# EasyEDA Pro project NeuraCore-Final.epro, schematic schematic1, sheets 1 to 6 of 13

## Sheets
1 Misc: Board Name: Board1; Create Date: 2024-11-09; Page Name: Misc; Project Name: FPGA Dev Board - XILINX XC7Z020-1CLG484I v0.07; Schematic Name: schematic1; Update Date: 2025-03-01; Company: EasyEDA.com; Drawn: rehsd; Page Size: B; Part Number: JLCPCB-002; Reviewed: EasyEDA; Version: V0.1
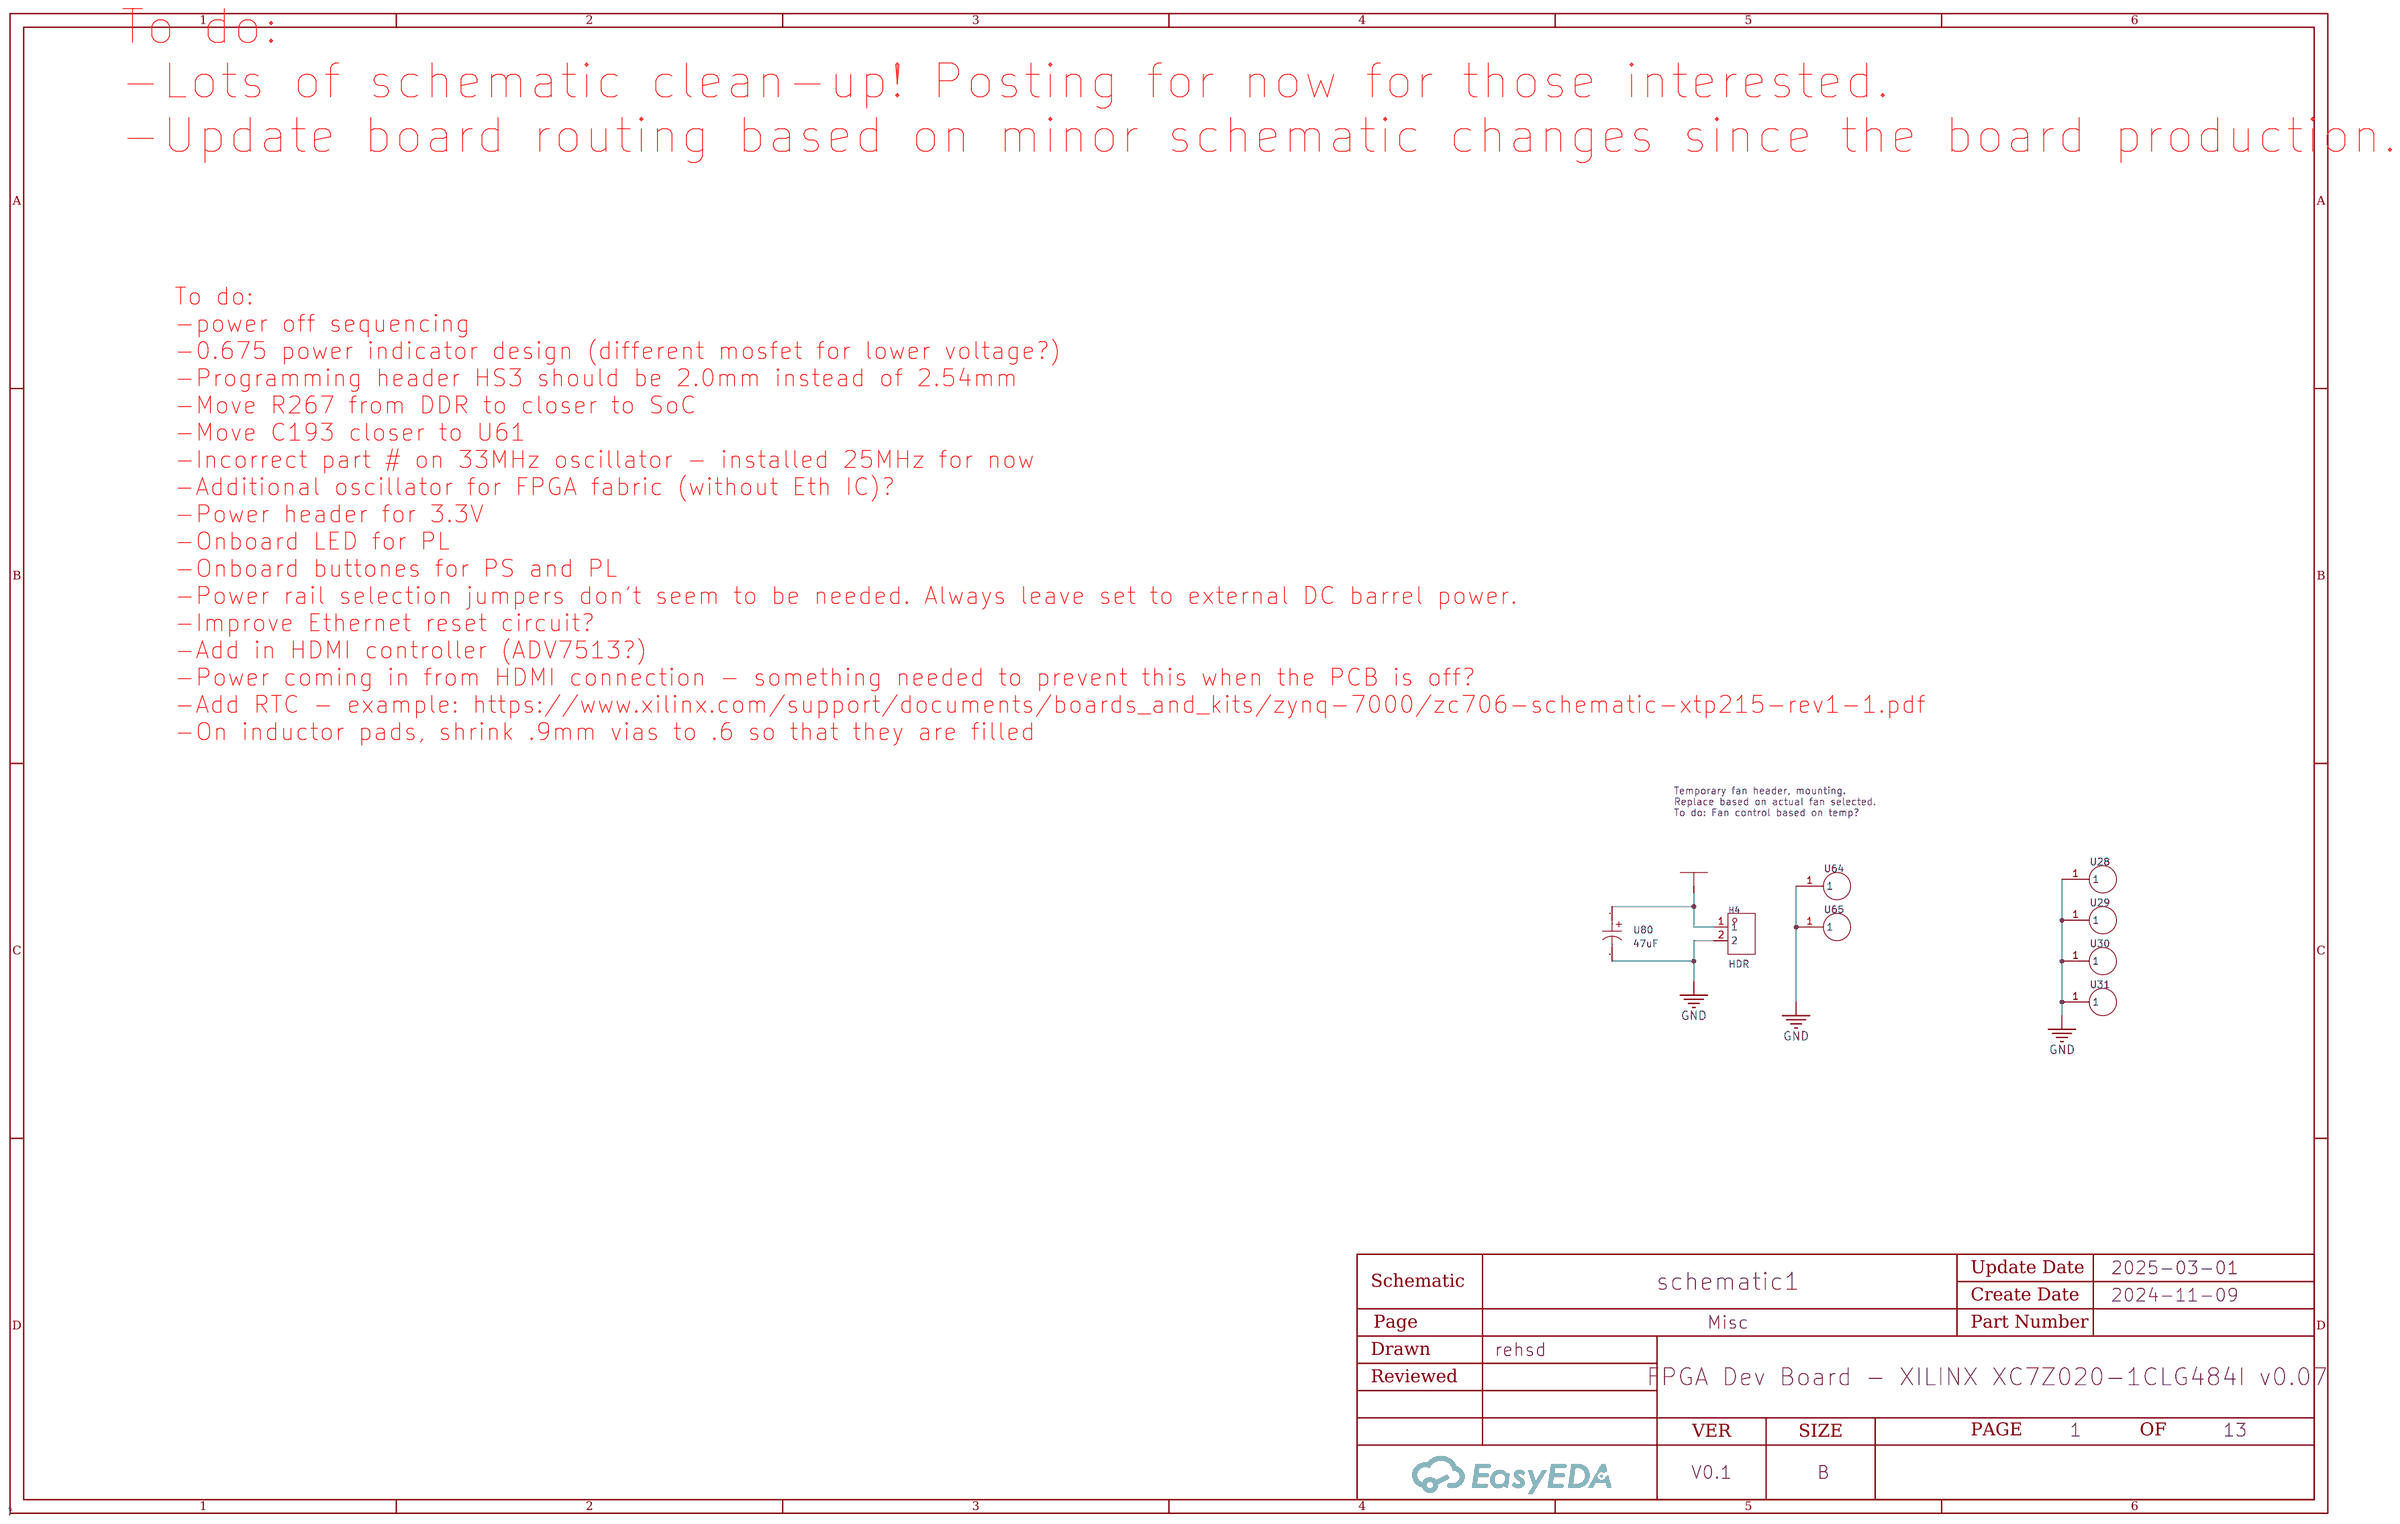
[diagram p0: Misc]
2 Regulators: Page Name: Regulators; Update Date: 2024-11-09
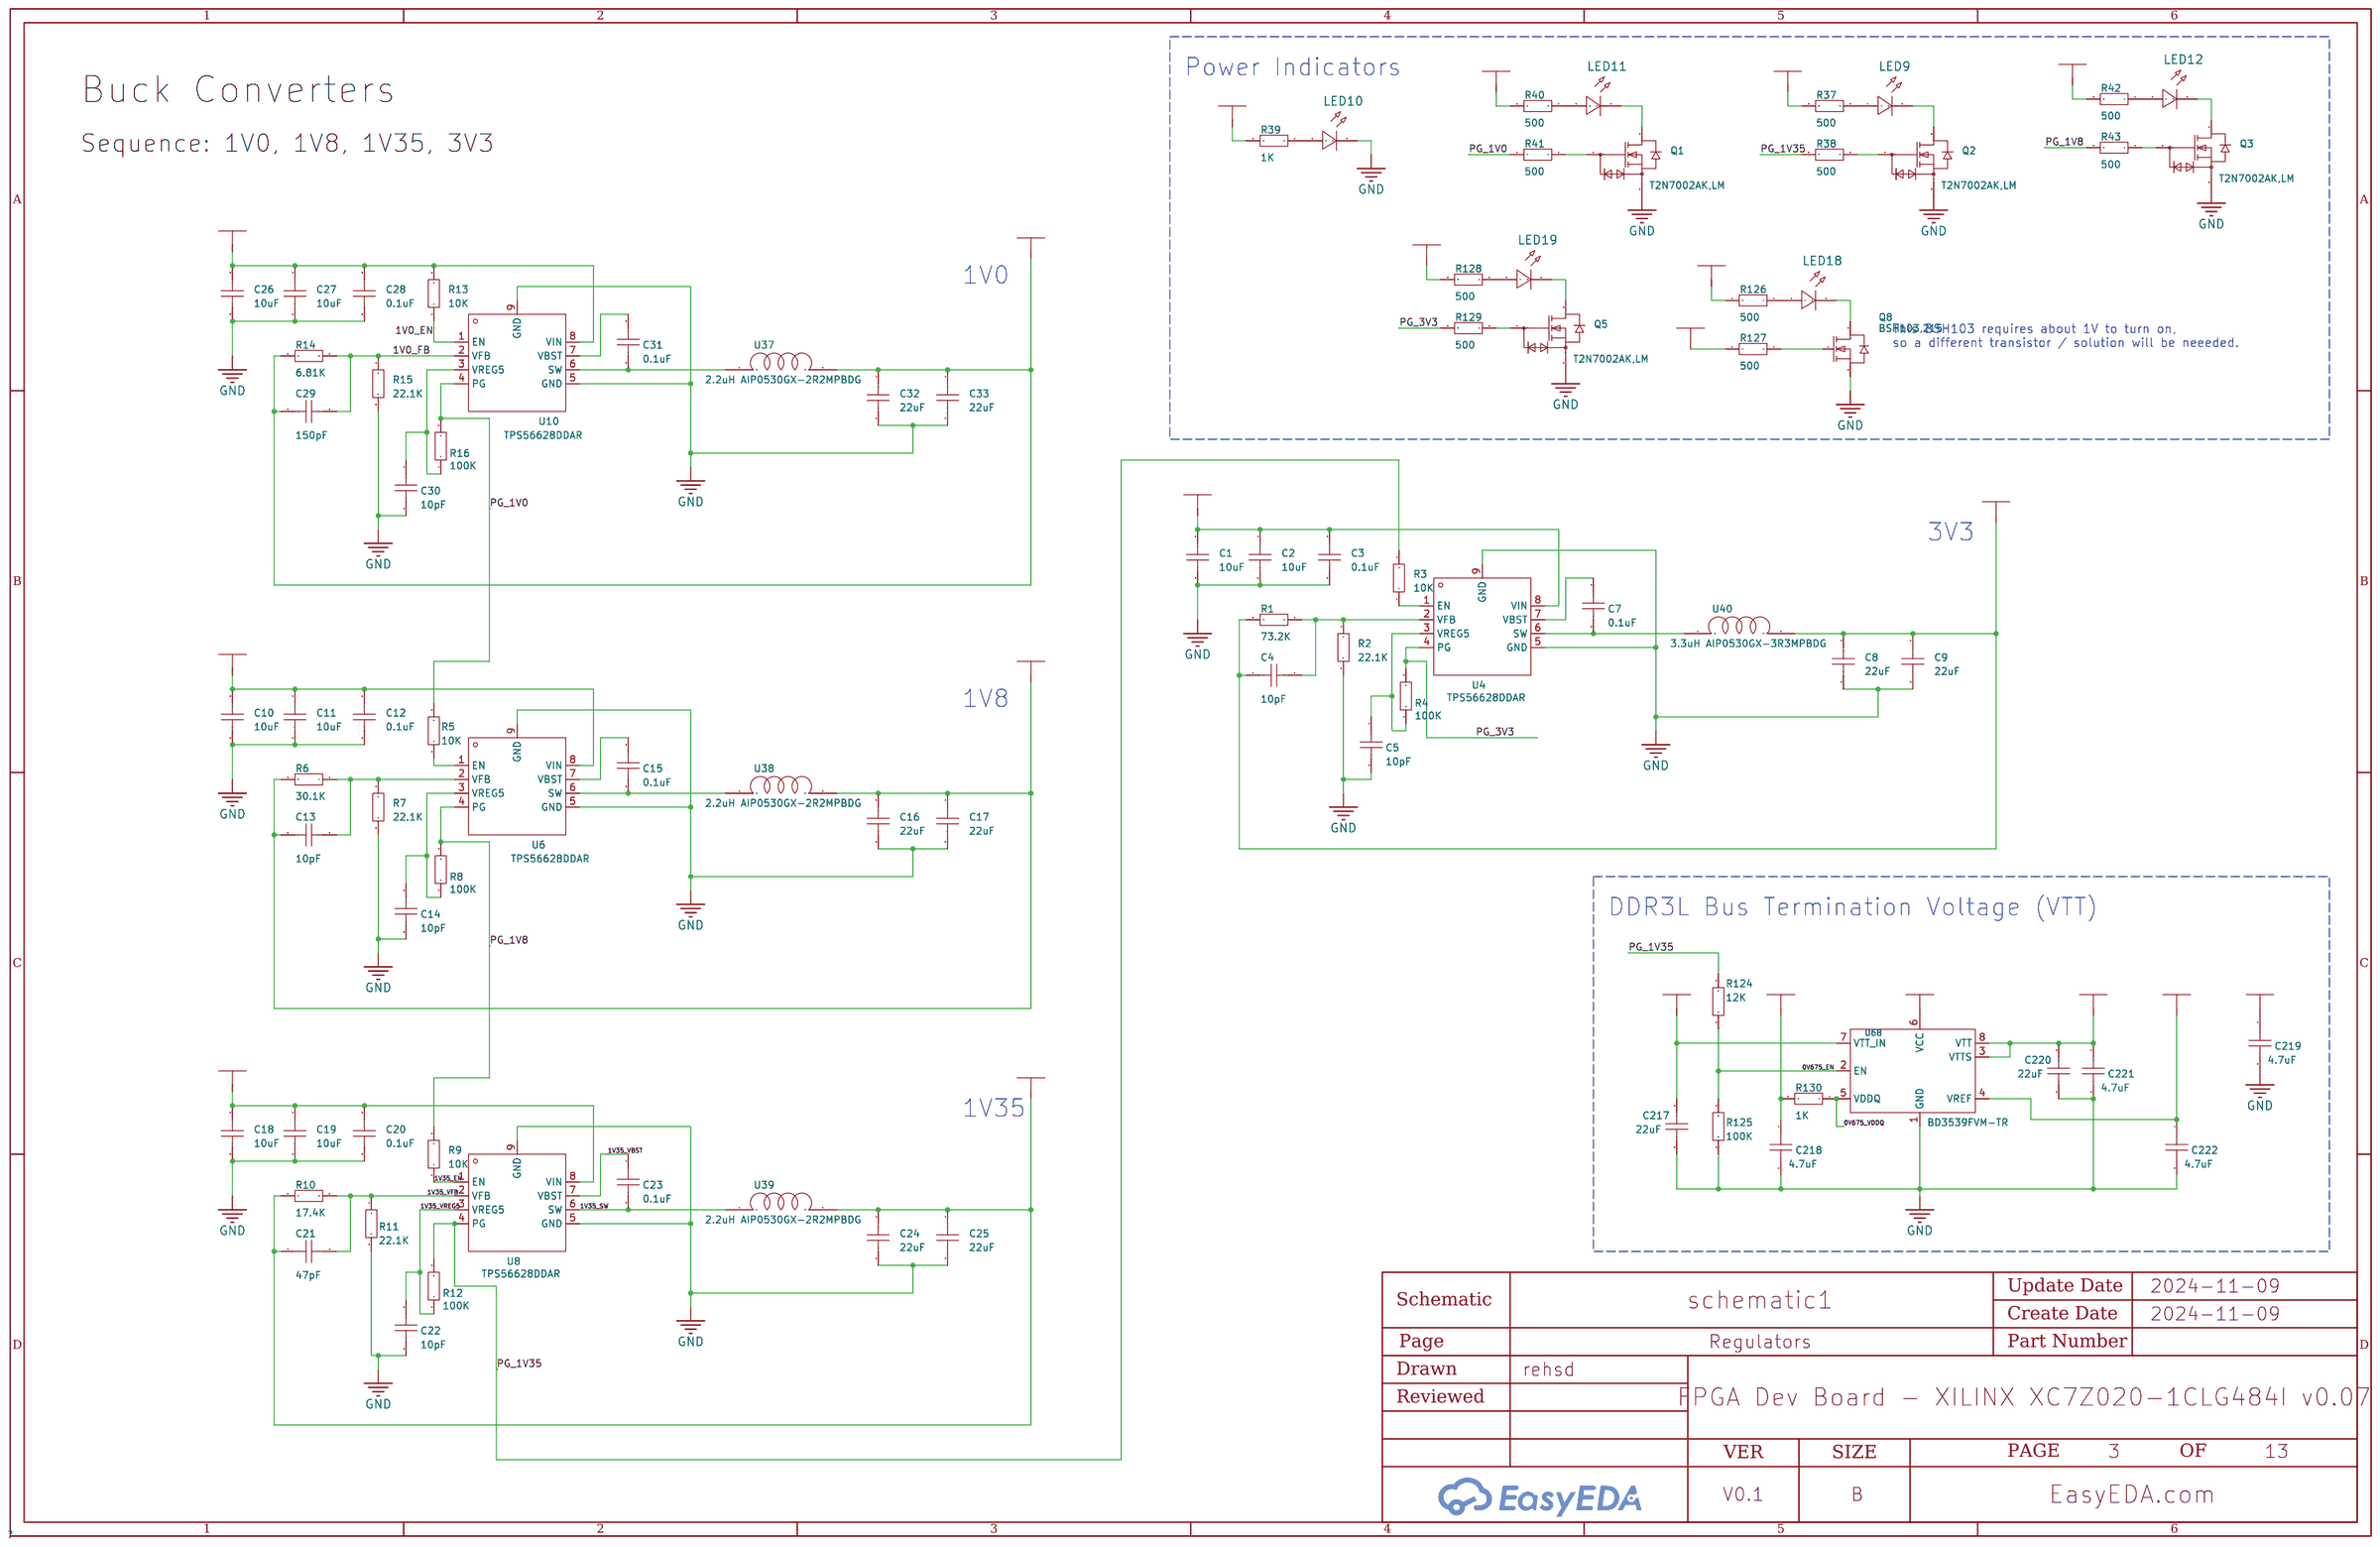
[diagram p1: Regulators]
3 Power: Page Name: Power; Update Date: 2024-11-09
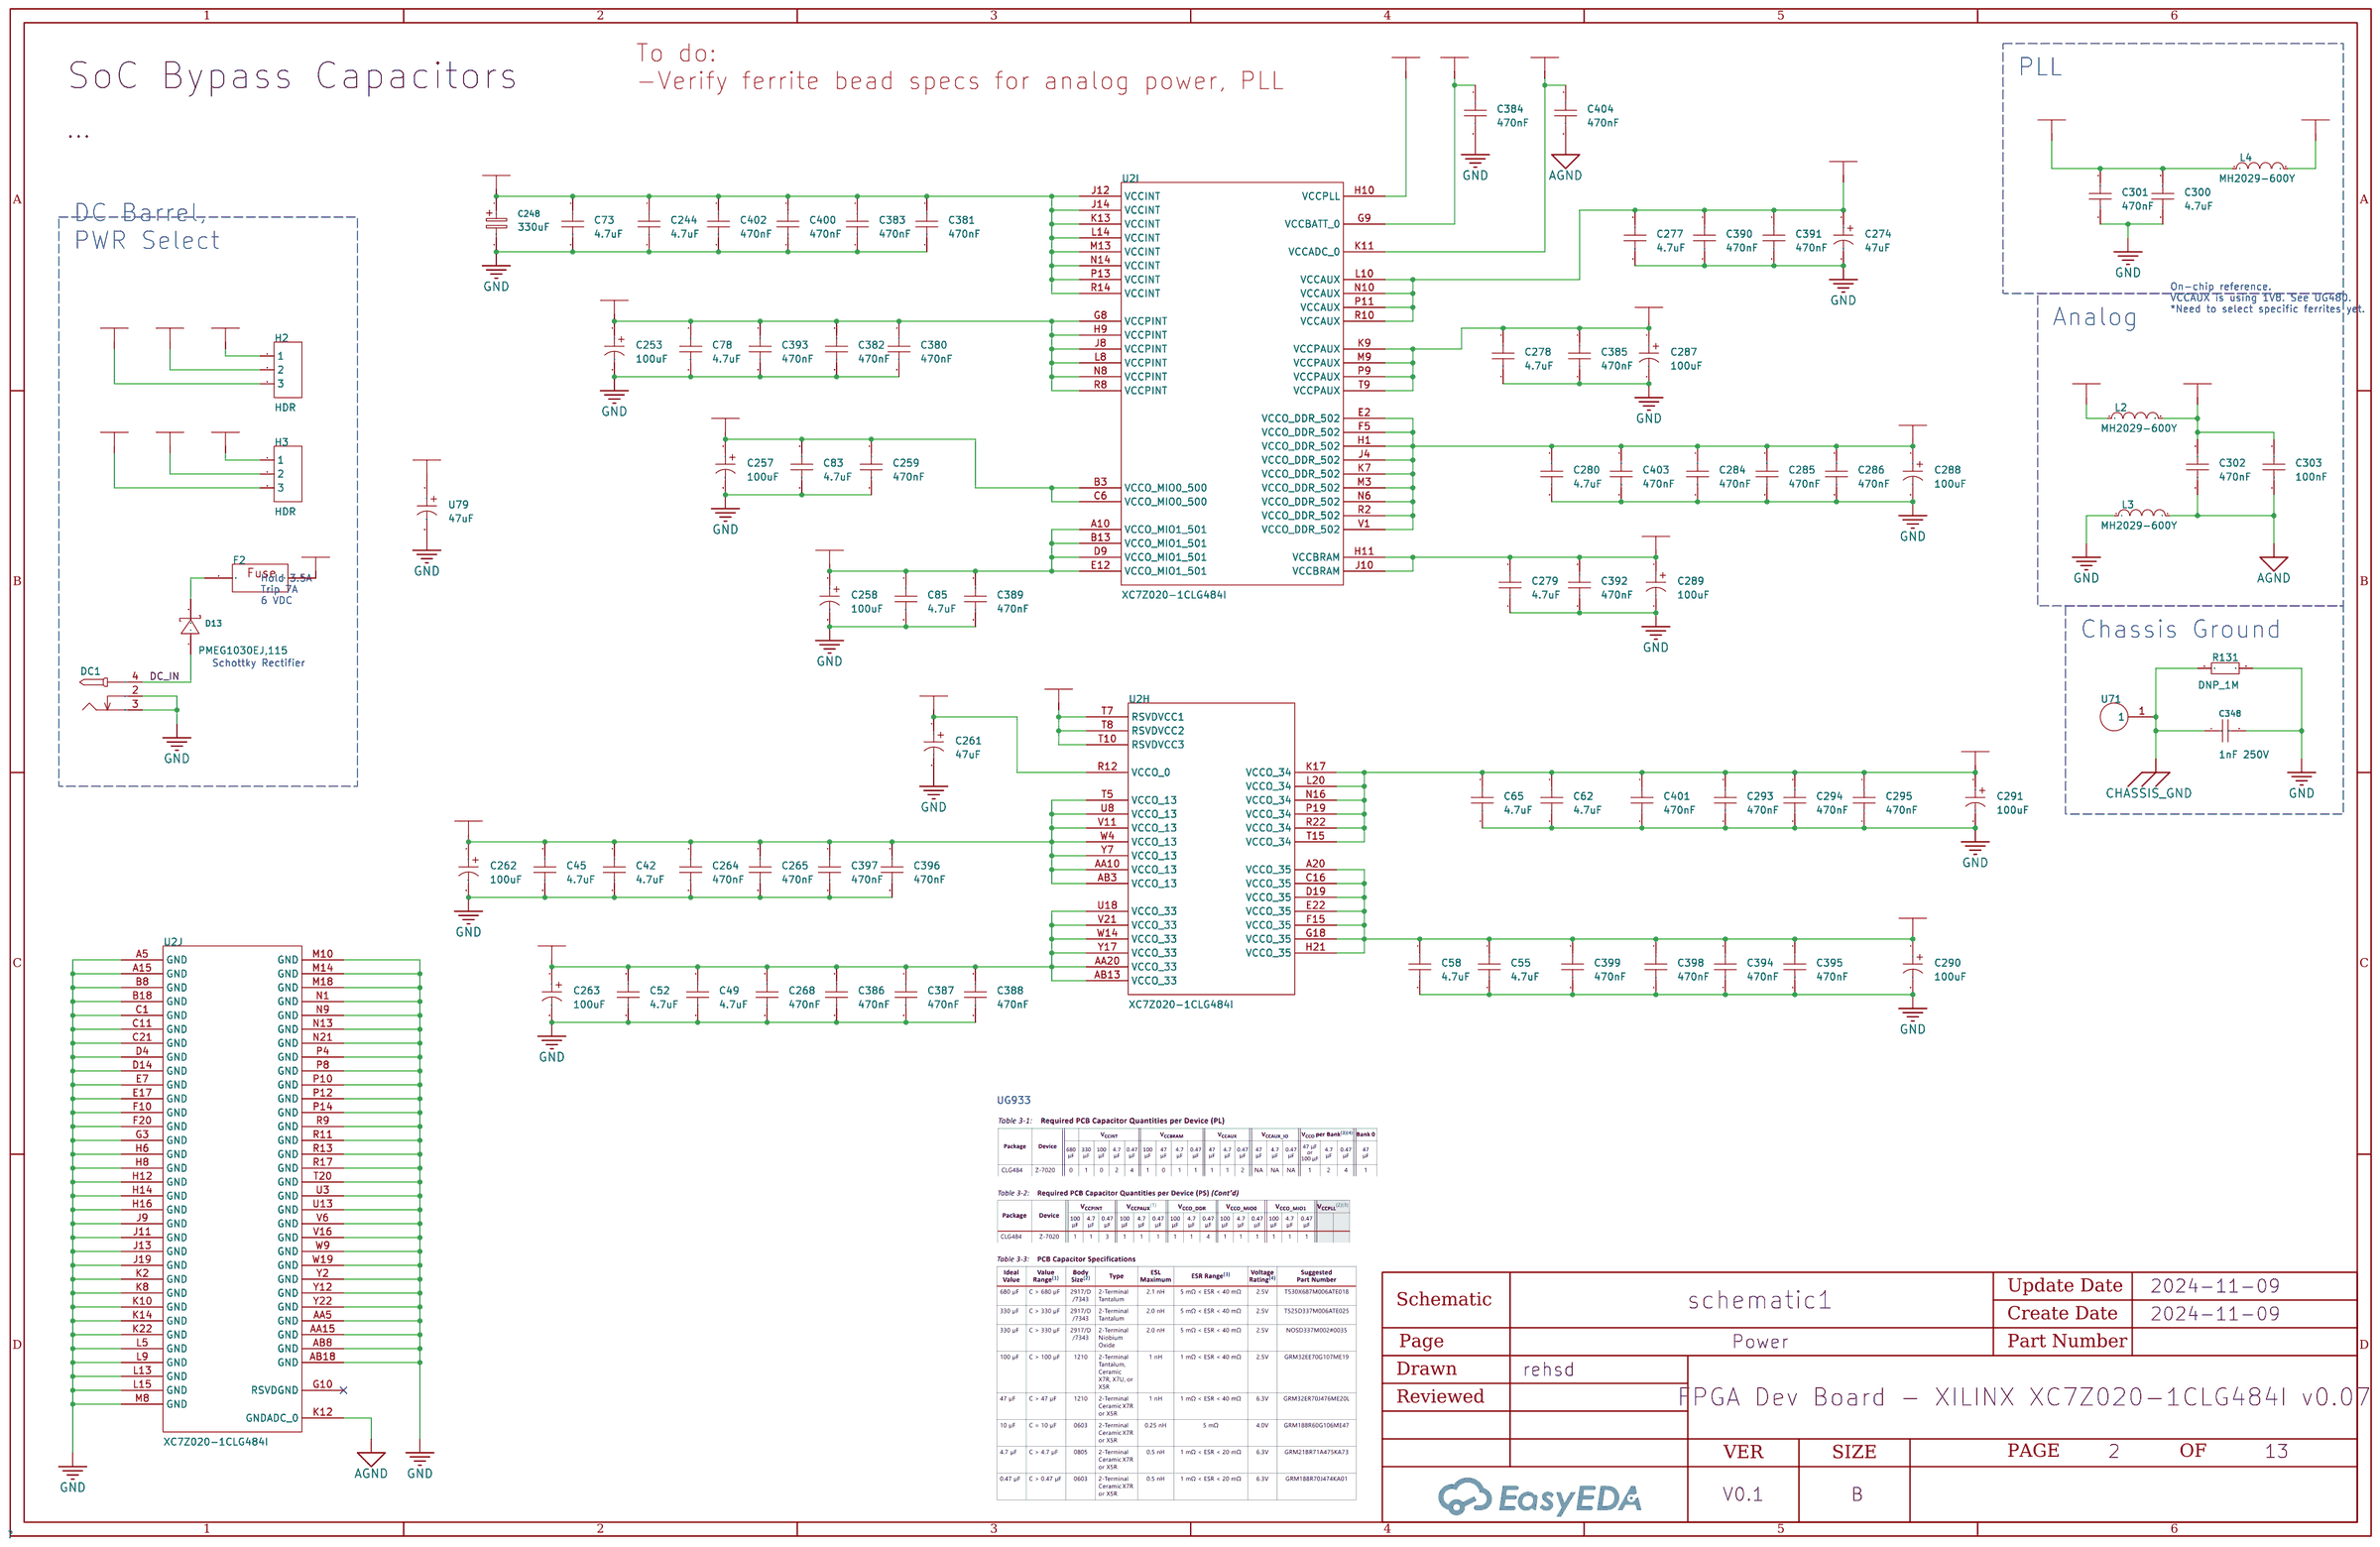
[diagram p2: Power]
4 DDR3L: Create Date: 2024-05-27; Page Name: DDR3L; Project Name: FPGA Dev Board - XILINX XC7Z020-1CLG484I v0.04; Update Date: 2024-06-02
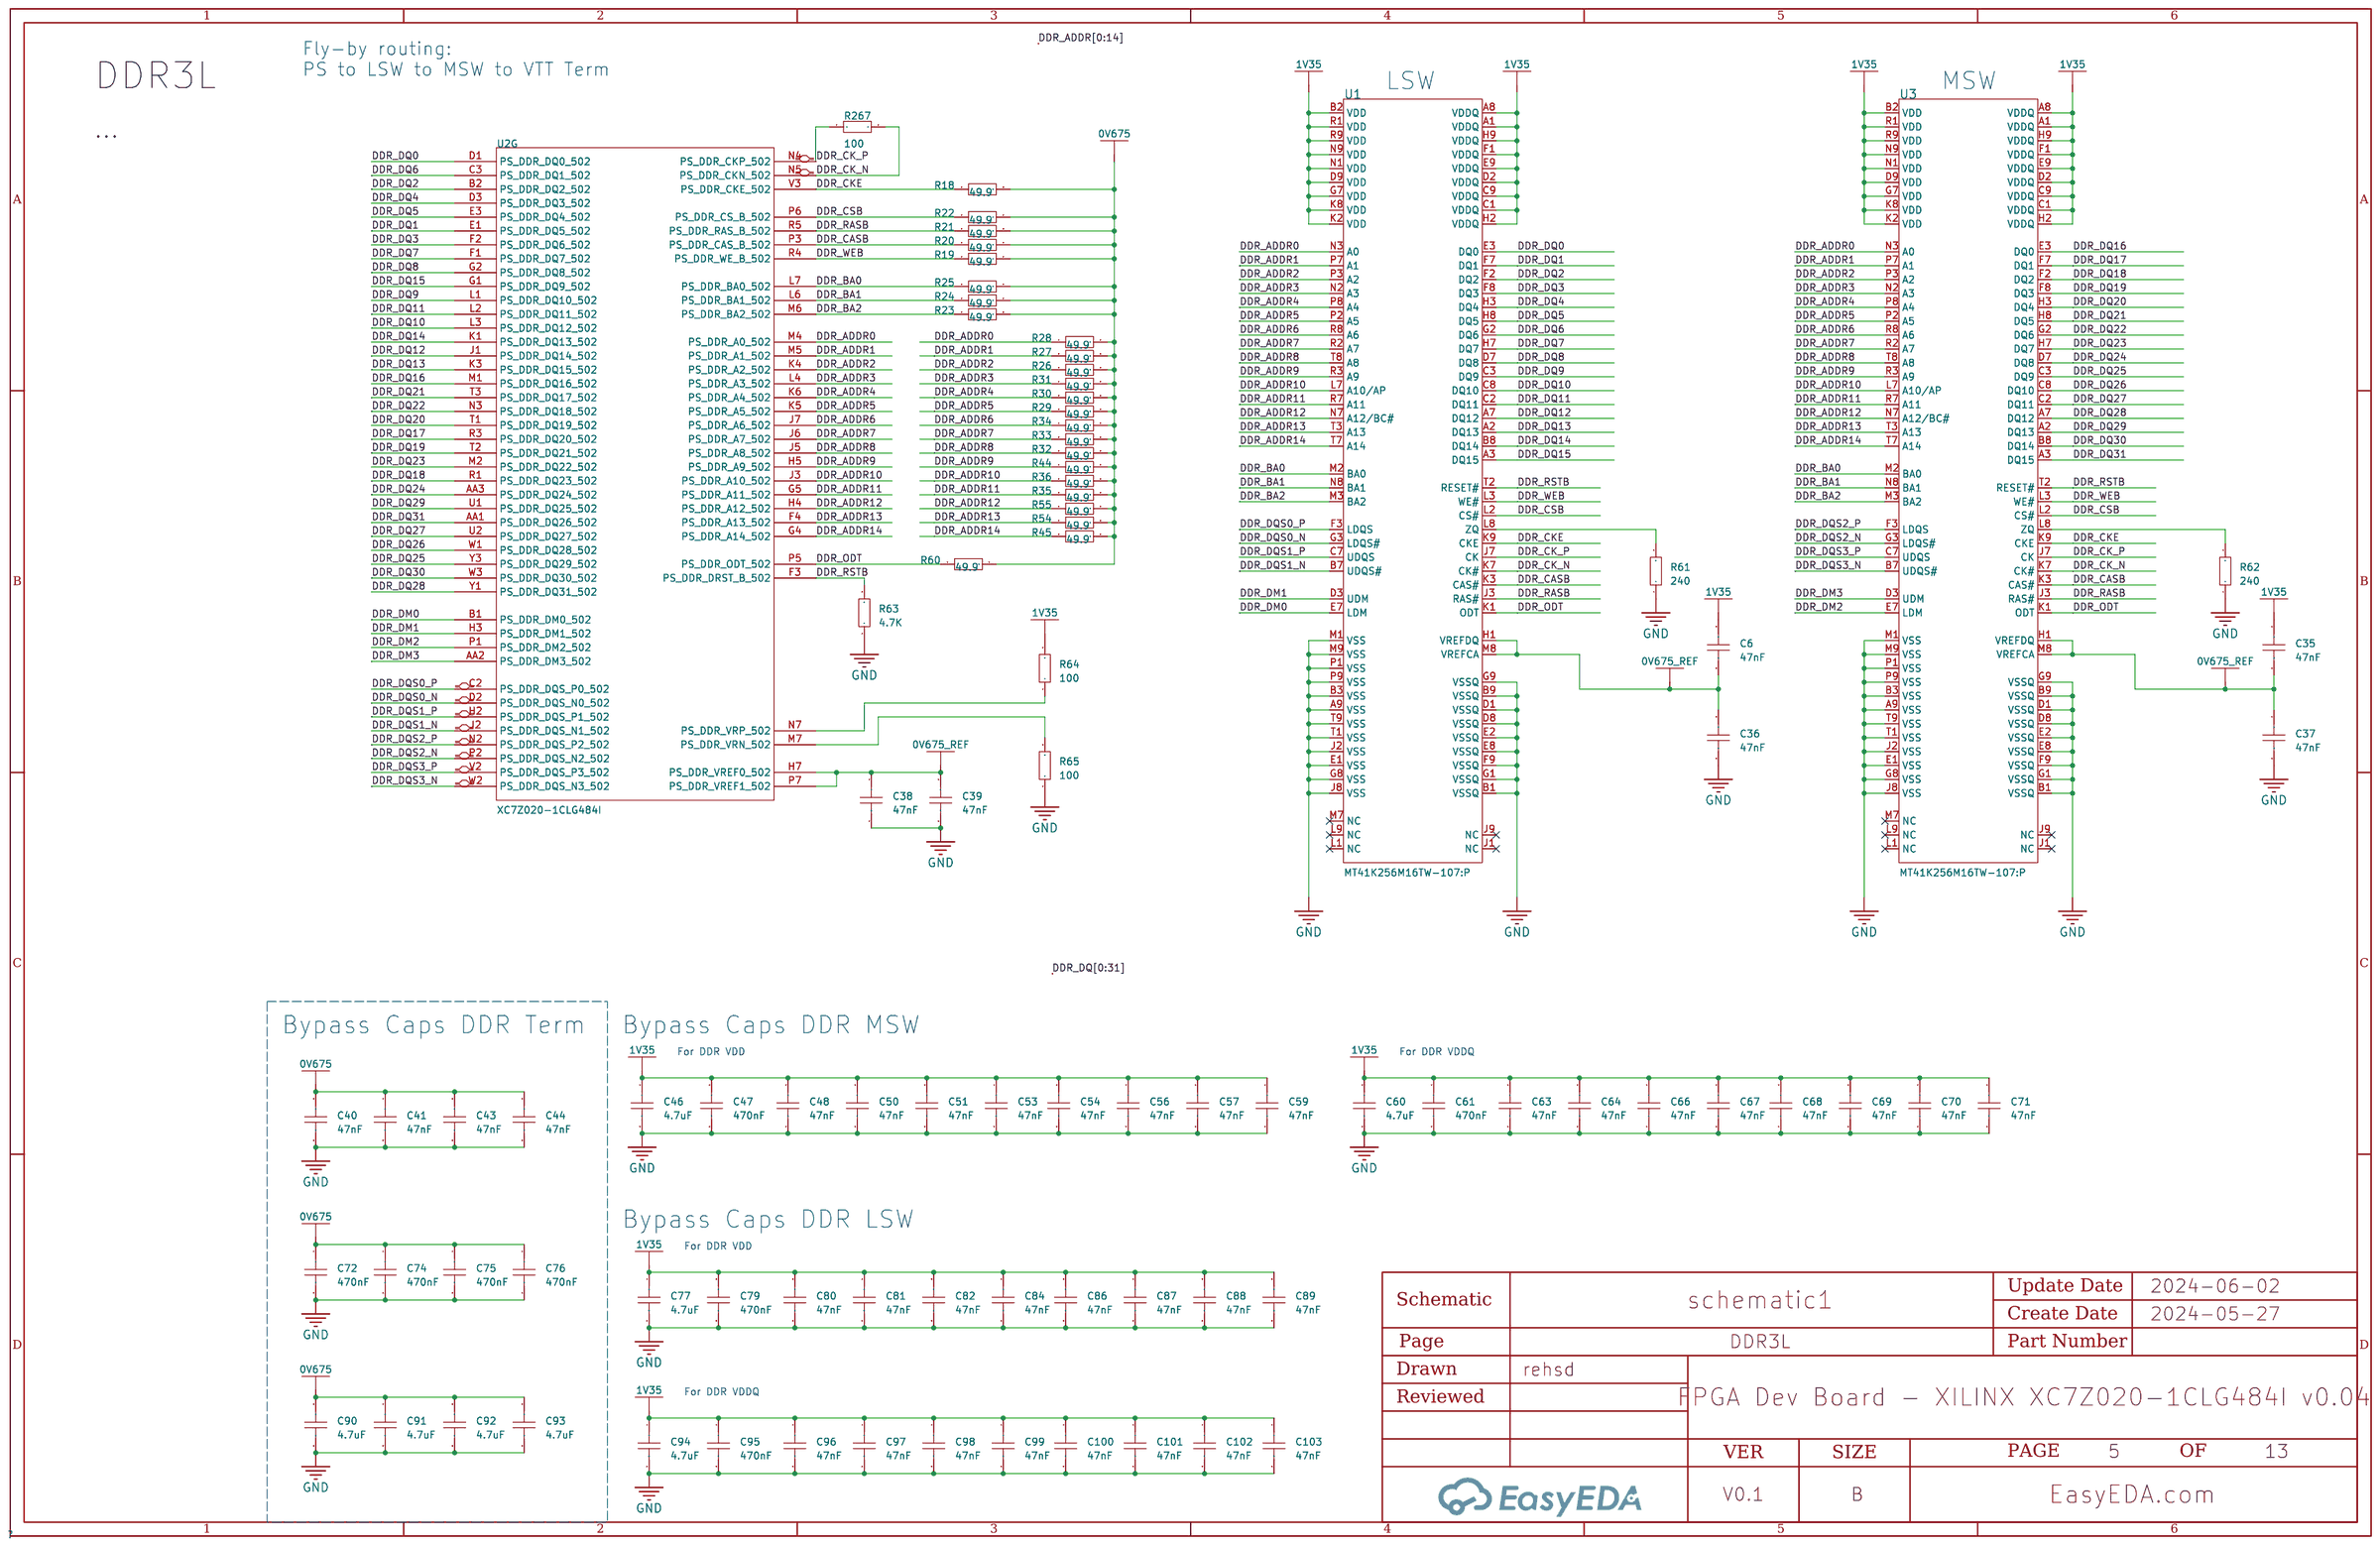
[diagram p3: DDR3L]
5 USB FT2232: Page Name: USB FT2232; Update Date: 2025-03-07; Drawn: EasyEDA; Page Size: A4
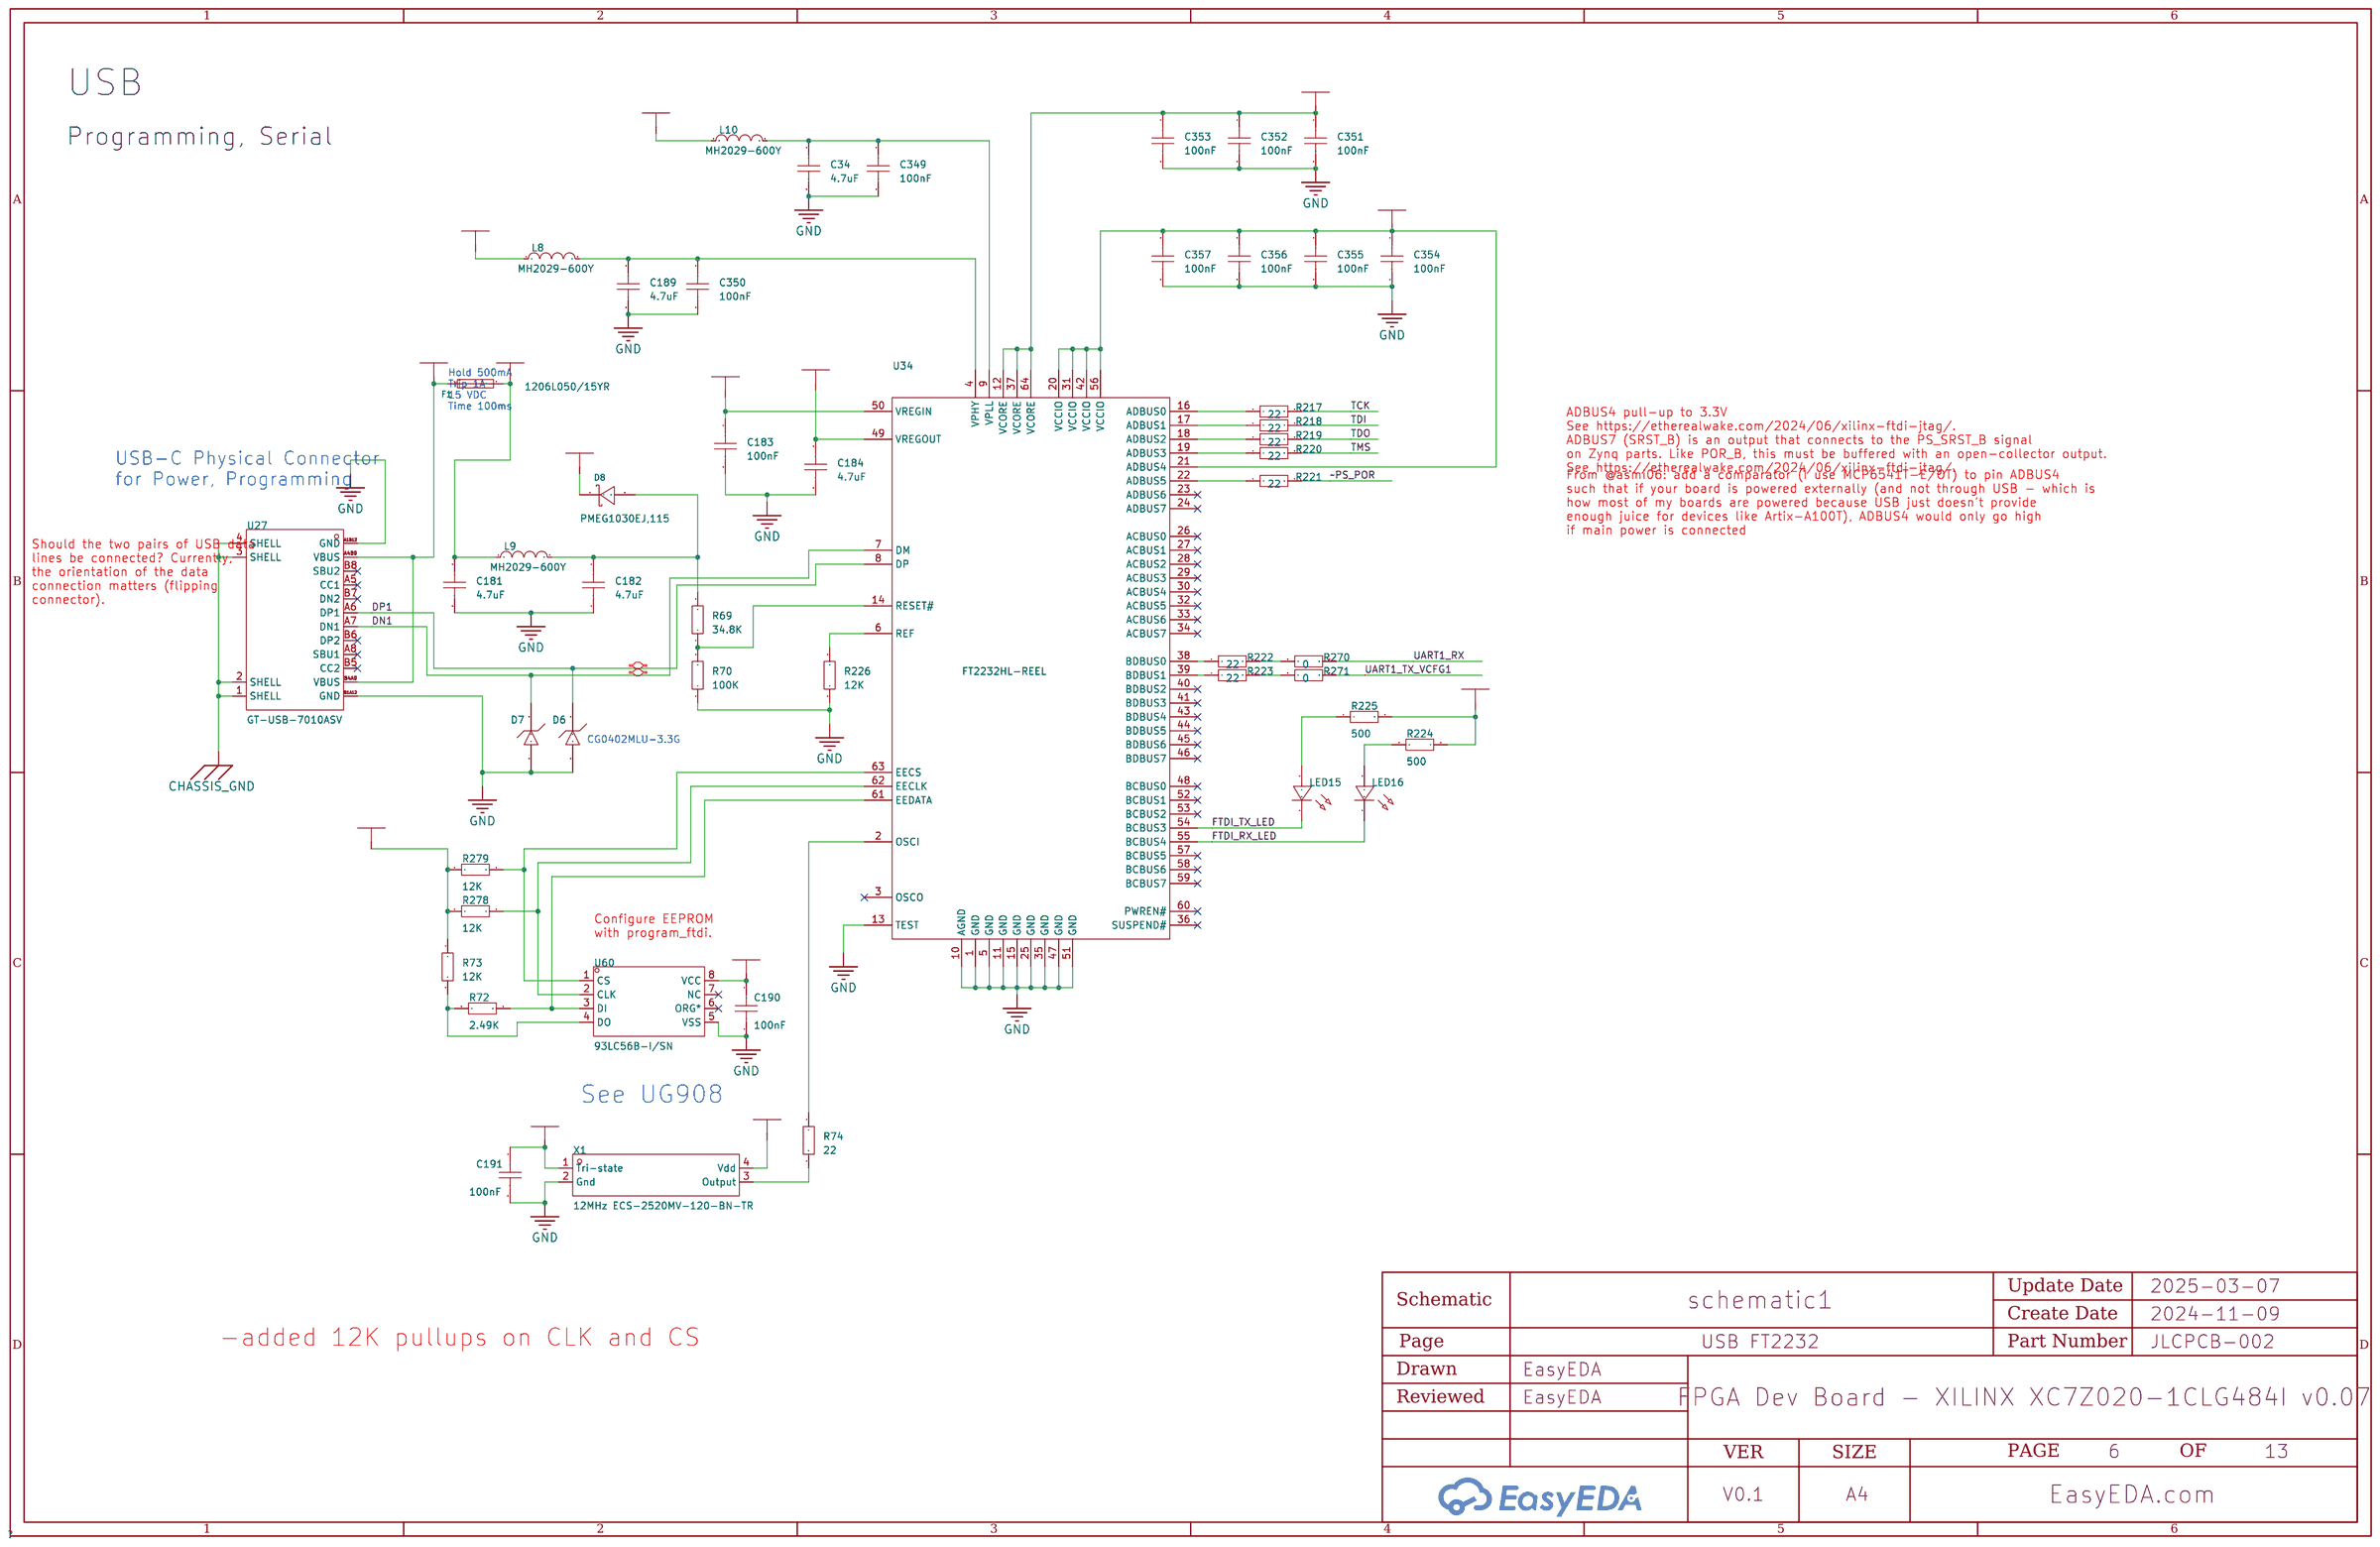
[diagram p4: USB FT2232]
6 Ethernet: Page Name: Ethernet; Update Date: 2024-11-09; Drawn: EasyEDA; Page Size: A4
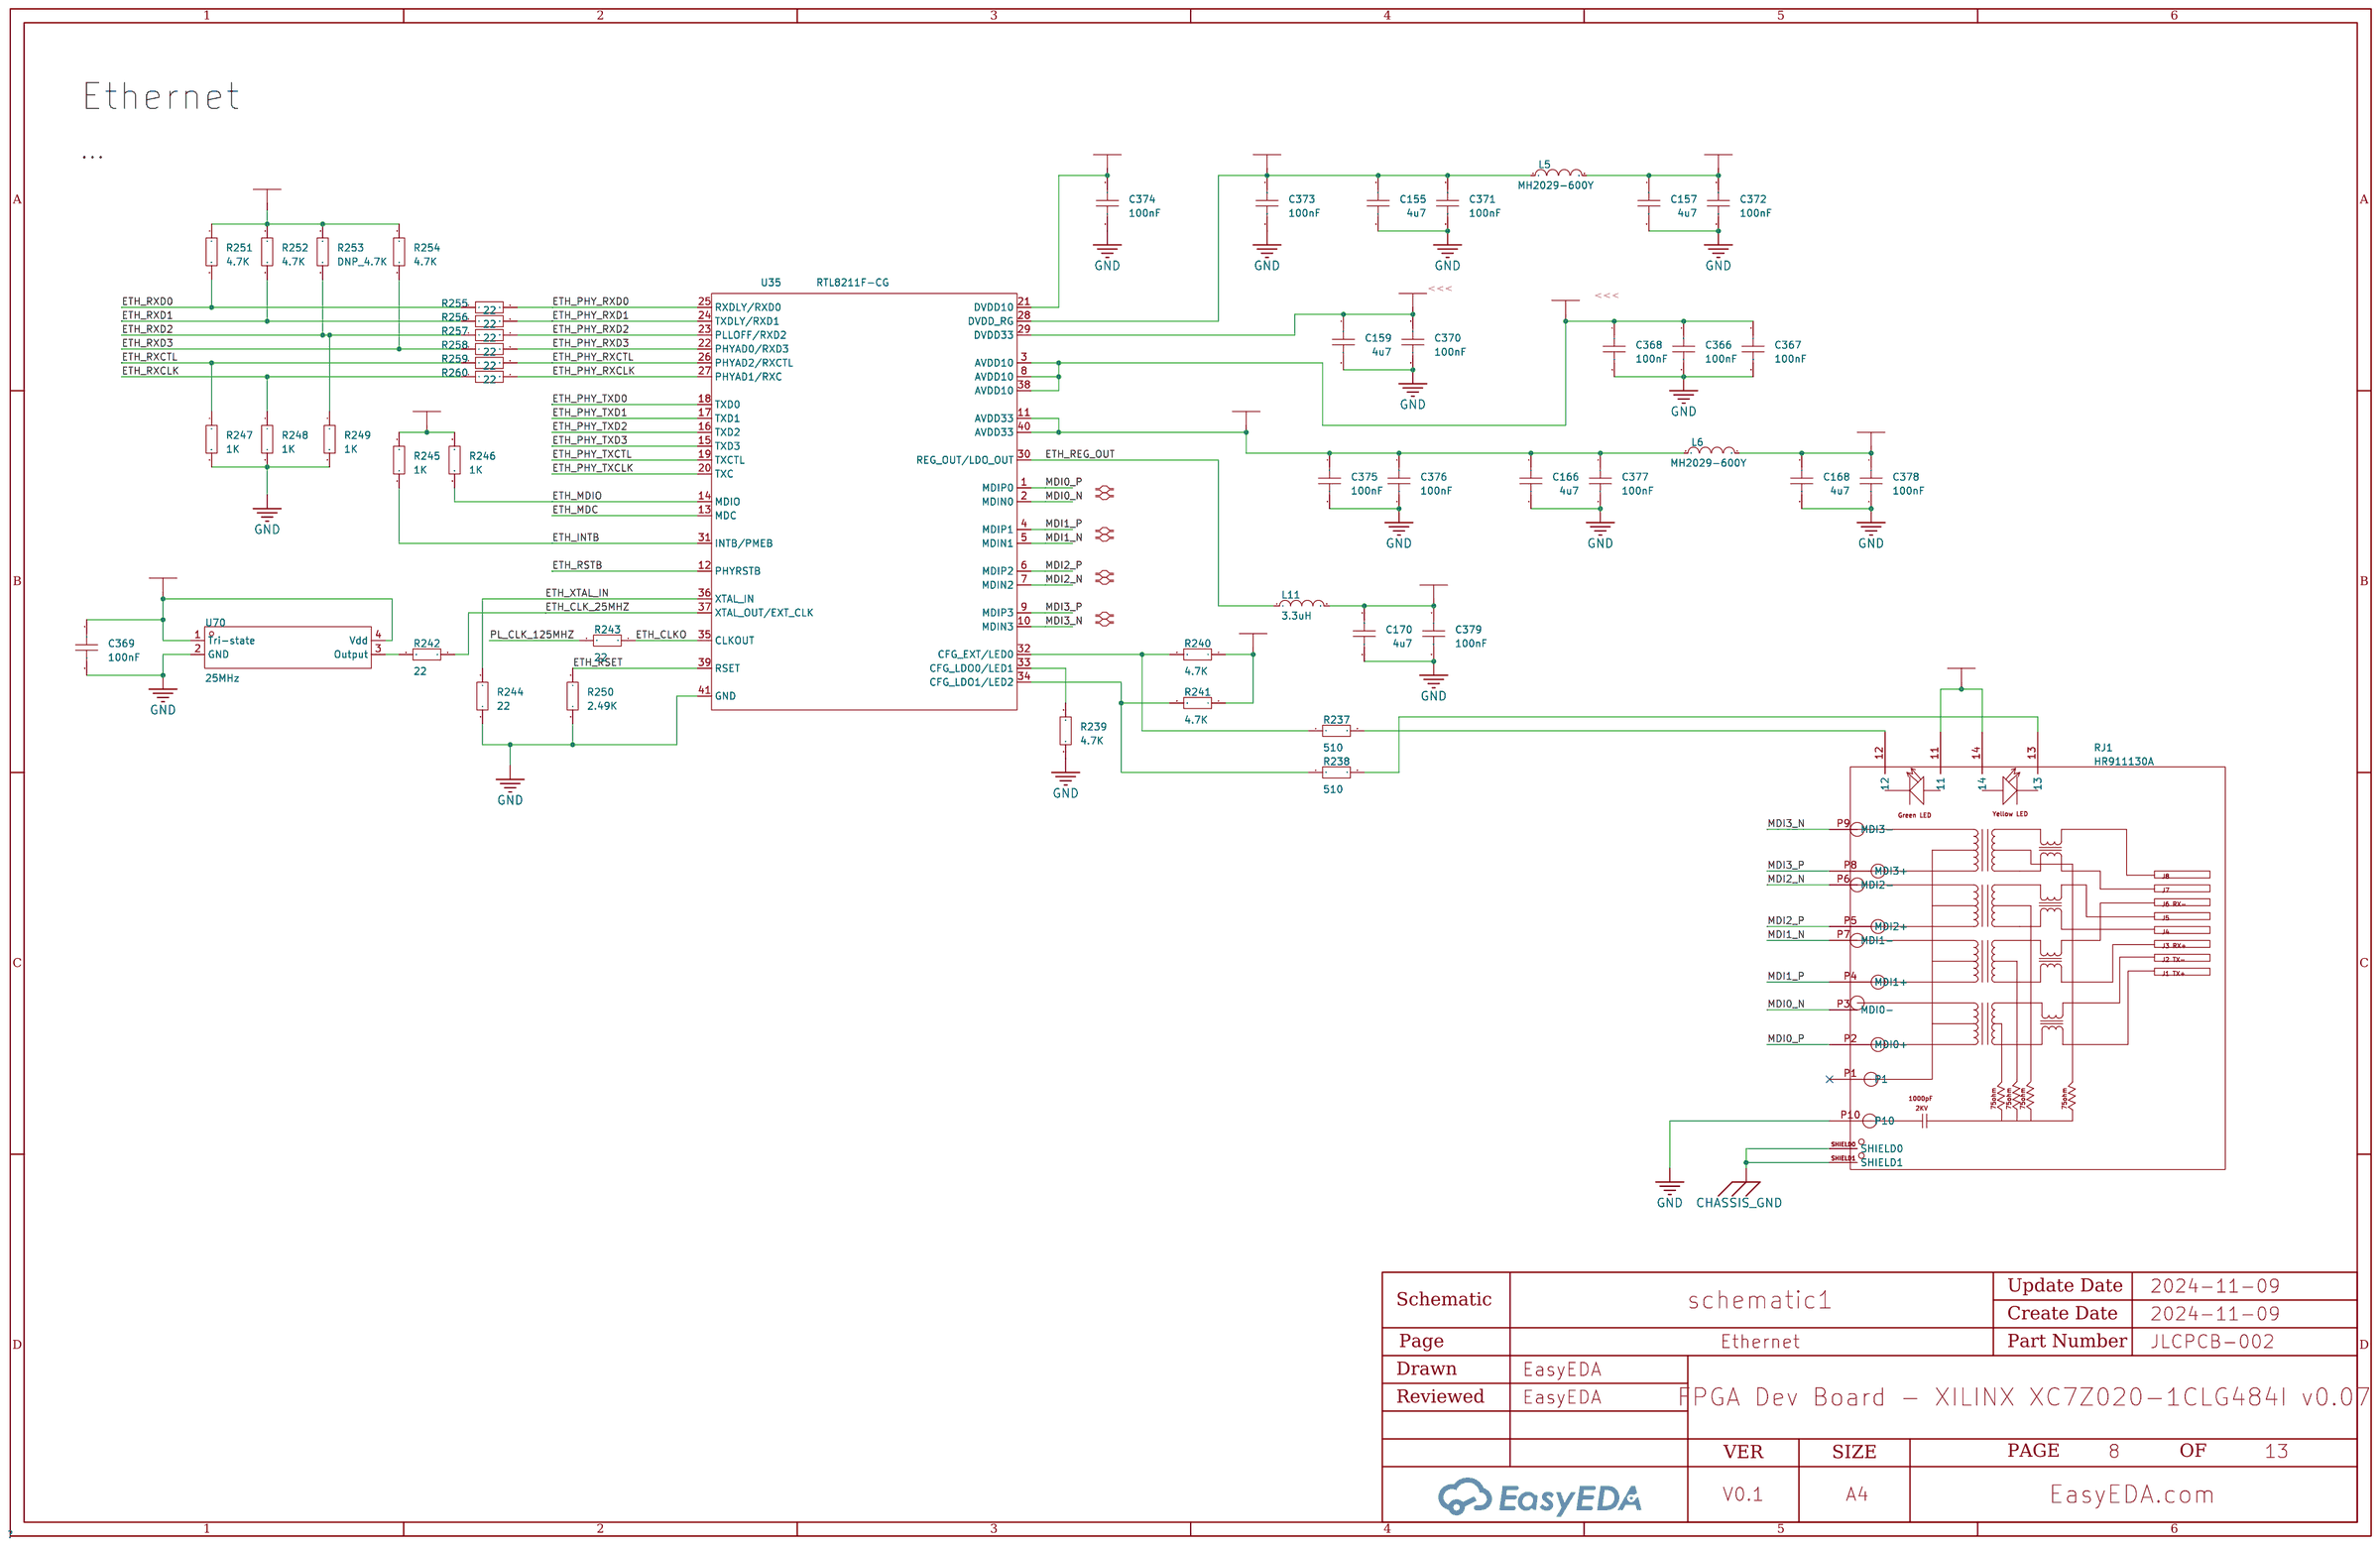
[diagram p5: Ethernet]

## Parts
sheet DDR3L
C6  47nF  [C0603]
C35  47nF  [C0603]
C36  47nF  [C0603]
C37  47nF  [C0603]
C38  47nF  [C0603]
C39  47nF  [C0603]
C40  47nF  [C0402]
C41  47nF  [C0402]
C43  47nF  [C0402]
C44  47nF  [C0402]
C46  4.7uF  [C0603]
C47  470nF  [C0402]
C48  47nF  [C0402]
C50  47nF  [C0402]
C51  47nF  [C0402]
C53  47nF  [C0402]
C54  47nF  [C0402]
C56  47nF  [C0402]
C57  47nF  [C0402]
C59  47nF  [C0402]
C60  4.7uF  [C0603]
C61  470nF  [C0402]
C63  47nF  [C0402]
C64  47nF  [C0402]
C66  47nF  [C0402]
C67  47nF  [C0402]
C68  47nF  [C0402]
C69  47nF  [C0402]
C70  47nF  [C0402]
C71  47nF  [C0402]
C72  470nF  [C0402]
C74  470nF  [C0402]
C75  470nF  [C0402]
C76  470nF  [C0402]
C77  4.7uF  [C0603]
C79  470nF  [C0402]
C80  47nF  [C0402]
C81  47nF  [C0402]
C82  47nF  [C0402]
C84  47nF  [C0402]
C86  47nF  [C0402]
C87  47nF  [C0402]
C88  47nF  [C0402]
C89  47nF  [C0402]
C90  4.7uF  [C0603]
C91  4.7uF  [C0603]
C92  4.7uF  [C0603]
C93  4.7uF  [C0603]
C94  4.7uF  [C0603]
C95  470nF  [C0402]
C96  47nF  [C0402]
C97  47nF  [C0402]
C98  47nF  [C0402]
C99  47nF  [C0402]
C100  47nF  [C0402]
C101  47nF  [C0402]
C102  47nF  [C0402]
C103  47nF  [C0402]
R18  49.9  [R0402]
R19  49.9  [R0402]
R20  49.9  [R0402]
R21  49.9  [R0402]
R22  49.9  [R0402]
R23  49.9  [R0402]
R24  49.9  [R0402]
R25  49.9  [R0402]
R26  49.9  [R0402]
R27  49.9  [R0402]
R28  49.9  [R0402]
R29  49.9  [R0402]
R30  49.9  [R0402]
R31  49.9  [R0402]
R32  49.9  [R0402]
R33  49.9  [R0402]
R34  49.9  [R0402]
R35  49.9  [R0402]
R36  49.9  [R0402]
R44  49.9  [R0402]
R45  49.9  [R0402]
R54  49.9  [R0402]
R55  49.9  [R0402]
R60  49.9  [R0402]
R61  240  [R0603]
R62  240  [R0603]
R63  4.7K  [R0603]
R64  100  [R0603]
R65  100  [R0603]
R267  100  [R0201]
U1  MT41K256M16TW-107:P  [FBGA-96_L14.0-W8.0-R16-C6-P0.80-TL]
U3  MT41K256M16TW-107:P  [FBGA-96_L14.0-W8.0-R16-C6-P0.80-TL]
sheet Ethernet
C155  4u7  [C0603]
C157  4u7  [C0603]
C159  4u7  [C0603]
C166  4u7  [C0603]
C168  4u7  [C0603]
C170  4u7  [C0603]
C366  100nF  [C0402]
C367  100nF  [C0402]
C368  100nF  [C0402]
C369  100nF  [C0402]
C370  100nF  [C0402]
C371  100nF  [C0402]
C372  100nF  [C0402]
C373  100nF  [C0402]
C374  100nF  [C0402]
C375  100nF  [C0402]
C376  100nF  [C0402]
C377  100nF  [C0402]
C378  100nF  [C0402]
C379  100nF  [C0402]
L5  MH2029-600Y  [L0805]
L6  MH2029-600Y  [L0805]
L11  3.3uH  [L0603]
R237  510  [R0402]
R238  510  [R0402]
R239  4.7K  [R0402]
R240  4.7K  [R0402]
R241  4.7K  [R0402]
R242  22  [R0402]
R243  22  [R0402]
R244  22  [R0402]
R245  1K  [R0402]
R246  1K  [R0402]
R247  1K  [R0402]
R248  1K  [R0402]
R249  1K  [R0402]
R250  2.49K  [R0402]
R251  4.7K  [R0402]
R252  4.7K  [R0402]
R253  DNP_4.7K  [R0402]
R254  4.7K  [R0402]
R255  22  [R0402]
R256  22  [R0402]
R257  22  [R0402]
R258  22  [R0402]
R259  22  [R0402]
R260  22  [R0402]
RJ1  HR911130A  [RJ45-TH_HR911130A]
U35  RTL8211F-CG  [WQFN-40_L5.0-W5.0-P0.4-BL-EP]
U70  25MHz  [OSC-SMD_4P-L2.5-W2.0-BL-1]
sheet Misc
H4  HDR  [HDR-TH_2P-P2.54-V-M]
U28  -  [Standoff 3.0mm]
U29  -  [Standoff 3.0mm]
U30  -  [Standoff 3.0mm]
U31  -  [Standoff 3.0mm]
U64  -  [Standoff 2.0mm]
U65  -  [Standoff 2.0mm]
U80  47uF  [CAP-SMD_L7.3-W4.3-RD]
sheet Power
C42  4.7uF  [C0603]
C45  4.7uF  [C0603]
C49  4.7uF  [C0603]
C52  4.7uF  [C0603]
C55  4.7uF  [C0603]
C58  4.7uF  [C0603]
C62  4.7uF  [C0603]
C65  4.7uF  [C0603]
C73  4.7uF  [C0603]
C78  4.7uF  [C0603]
C83  4.7uF  [C0603]
C85  4.7uF  [C0603]
C244  4.7uF  [C0603]
C248  330uF  [CAP-SMD_L7.3-W4.3-L-FD]
C253  100uF  [CAP-SMD_L3.5-W2.8-FD]
C257  100uF  [CAP-SMD_L3.5-W2.8-FD]
C258  100uF  [CAP-SMD_L3.5-W2.8-FD]
C259  470nF  [C0402]
C261  47uF  [CAP-SMD_L3.5-W2.8-FD]
C262  100uF  [CAP-SMD_L3.5-W2.8-FD]
C263  100uF  [CAP-SMD_L3.5-W2.8-FD]
C264  470nF  [C0402]
C265  470nF  [C0402]
C268  470nF  [C0402]
C274  47uF  [CAP-SMD_L3.5-W2.8-FD]
C277  4.7uF  [C0603]
C278  4.7uF  [C0603]
C279  4.7uF  [C0603]
C280  4.7uF  [C0603]
C284  470nF  [C0402]
C285  470nF  [C0402]
C286  470nF  [C0402]
C287  100uF  [CAP-SMD_L3.5-W2.8-FD]
C288  100uF  [CAP-SMD_L3.5-W2.8-FD]
C289  100uF  [CAP-SMD_L3.5-W2.8-FD]
C290  100uF  [CAP-SMD_L3.5-W2.8-FD]
C291  100uF  [CAP-SMD_L3.5-W2.8-FD]
C293  470nF  [C0402]
C294  470nF  [C0402]
C295  470nF  [C0402]
C300  4.7uF  [C0603]
C301  470nF  [C0402]
C302  470nF  [C0402]
C303  100nF  [C0402]
C348  1nF 250V  [C1206]
C380  470nF  [C0201]
C381  470nF  [C0201]
C382  470nF  [C0201]
C383  470nF  [C0201]
C384  470nF  [C0201]
C385  470nF  [C0201]
C386  470nF  [C0201]
C387  470nF  [C0201]
C388  470nF  [C0201]
C389  470nF  [C0201]
C390  470nF  [C0201]
C391  470nF  [C0201]
C392  470nF  [C0201]
C393  470nF  [C0201]
C394  470nF  [C0201]
C395  470nF  [C0201]
C396  470nF  [C0201]
C397  470nF  [C0201]
C398  470nF  [C0201]
C399  470nF  [C0201]
C400  470nF  [C0201]
C401  470nF  [C0201]
C402  470nF  [C0201]
C403  470nF  [C0201]
C404  470nF  [C0201]
D13  PMEG1030EJ,115  [SOD-323_L1.8-W1.3-LS2.5-RD]
DC1  -  [DC-IN-TH_DC-5520-1]
F2  -  [F1210]
H2  HDR  [HDR-TH_3P-P2.54-V-M-1]
H3  HDR  [HDR-TH_3P-P2.54-V-M-1]
L2  MH2029-600Y  [L0805]
L3  MH2029-600Y  [L0805]
L4  MH2029-600Y  [L0805]
R131  DNP_1M  [R0603]
U2  XC7Z020-1CLG484I  [FBGA-484_L19.0-W19.0-R22-C22-P0.80-TL]  (sections 1,10,2,3,4,5,6,7,8,9)
U71  -  [Standoff 3.0mm]
U79  47uF  [CAP-SMD_L7.3-W4.3-RD]
sheet Regulators
C1  10uF  [C0603]
C2  10uF  [C0603]
C3  0.1uF  [C0603]
C4  10pF  [C0603]
C5  10pF  [C0603]
C7  0.1uF  [C0603]
C8  22uF  [C0603]
C9  22uF  [C0603]
C10  10uF  [C0603]
C11  10uF  [C0603]
C12  0.1uF  [C0603]
C13  10pF  [C0603]
C14  10pF  [C0603]
C15  0.1uF  [C0603]
C16  22uF  [C0603]
C17  22uF  [C0603]
C18  10uF  [C0603]
C19  10uF  [C0603]
C20  0.1uF  [C0603]
C21  47pF  [C0603]
C22  10pF  [C0603]
C23  0.1uF  [C0603]
C24  22uF  [C0603]
C25  22uF  [C0603]
C26  10uF  [C0603]
C27  10uF  [C0603]
C28  0.1uF  [C0603]
C29  150pF  [C0603]
C30  10pF  [C0603]
C31  0.1uF  [C0603]
C32  22uF  [C0603]
C33  22uF  [C0603]
C217  22uF  [C0603]
C218  4.7uF  [C0603]
C219  4.7uF  [C0603]
C220  22uF  [C0603]
C221  4.7uF  [C0603]
C222  4.7uF  [C0603]
LED9  -  [LED0603-R-RD]
LED10  -  [LED0603-R-RD]
LED11  -  [LED0603-R-RD]
LED12  -  [LED0603-R-RD]
LED18  -  [LED0603-R-RD]
LED19  -  [LED0603-R-RD]
Q1  T2N7002AK,LM  [SOT-23-3_L2.9-W1.3-P1.90-LS2.4-BR]
Q2  T2N7002AK,LM  [SOT-23-3_L2.9-W1.3-P1.90-LS2.4-BR]
Q3  T2N7002AK,LM  [SOT-23-3_L2.9-W1.3-P1.90-LS2.4-BR]
Q5  T2N7002AK,LM  [SOT-23-3_L2.9-W1.3-P1.90-LS2.4-BR]
Q8  BSH103,215  [TO-236AB_L2.9-W1.3-P0.95-LS2.3-BR]
R1  73.2K  [R0603]
R2  22.1K  [R0603]
R3  10K  [R0603]
R4  100K  [R0603]
R5  10K  [R0603]
R6  30.1K  [R0603]
R7  22.1K  [R0603]
R8  100K  [R0603]
R9  10K  [R0603]
R10  17.4K  [R0603]
R11  22.1K  [R0603]
R12  100K  [R0603]
R13  10K  [R0603]
R14  6.81K  [R0603]
R15  22.1K  [R0603]
R16  100K  [R0603]
R37  500  [R0603]
R38  500  [R0603]
R39  1K  [R0603]
R40  500  [R0603]
R41  500  [R0603]
R42  500  [R0603]
R43  500  [R0603]
R124  12K  [R0603]
R125  100K  [R0603]
R126  500  [R0603]
R127  500  [R0603]
R128  500  [R0603]
R129  500  [R0603]
R130  1K  [R0603]
U4  TPS56628DDAR  [SOIC-8_L4.9-W3.9-P1.27-LS6.0-BL-EP]
U6  TPS56628DDAR  [SOIC-8_L4.9-W3.9-P1.27-LS6.0-BL-EP]
U8  TPS56628DDAR  [SOIC-8_L4.9-W3.9-P1.27-LS6.0-BL-EP]
U10  TPS56628DDAR  [SOIC-8_L4.9-W3.9-P1.27-LS6.0-BL-EP]
U37  2.2uH AIP0530GX-2R2MPBDG  [Inductor 5.7mm X 5.4mm]
U38  2.2uH AIP0530GX-2R2MPBDG  [Inductor 5.7mm X 5.4mm]
U39  2.2uH AIP0530GX-2R2MPBDG  [Inductor 5.7mm X 5.4mm]
U40  3.3uH AIP0530GX-3R3MPBDG  [Inductor 5.7mm X 5.4mm]
U68  BD3539FVM-TR  [MSOP-8_L2.9-W2.8-P0.65-LS4.0-BL]
sheet USB FT2232
C34  4.7uF  [C0603]
C181  4.7uF  [C0603]
C182  4.7uF  [C0603]
C183  100nF  [C0603]
C184  4.7uF  [C0603]
C189  4.7uF  [C0603]
C190  100nF  [C0603]
C191  100nF  [C0603]
C349  100nF  [C0402]
C350  100nF  [C0402]
C351  100nF  [C0402]
C352  100nF  [C0402]
C353  100nF  [C0402]
C354  100nF  [C0402]
C355  100nF  [C0402]
C356  100nF  [C0402]
C357  100nF  [C0402]
D6  -  [D0402]
D7  -  [D0402]
D8  PMEG1030EJ,115  [SOD-323_L1.8-W1.3-LS2.5-RD]
F1  1206L050/15YR  [F1206]
L8  MH2029-600Y  [L0805]
L9  MH2029-600Y  [L0805]
L10  MH2029-600Y  [L0805]
LED15  -  [LED0603-RD_GREEN]
LED16  -  [LED0603-RD_GREEN]
R69  34.8K  [R0603]
R70  100K  [R0603]
R72  2.49K  [R0603]
R73  12K  [R0603]
R74  22  [R0603]
R217  22  [R0402]
R218  22  [R0402]
R219  22  [R0402]
R220  22  [R0402]
R221  22  [R0402]
R222  22  [R0402]
R223  22  [R0402]
R224  500  [R0402]
R225  500  [R0402]
R226  12K  [R0402]
R270  0  [R0603]
R271  0  [R0603]
R278  12K  [R0603]
R279  12K  [R0603]
U27  GT-USB-7010ASV  [USB-C-SMD_G-SWITCH_GT-USB-7010ASV]
U34  FT2232HL-REEL  [LQFP-64_L10.0-W10.0-P0.50-LS12.0-TL]
U60  93LC56B-I/SN  [SOIC-8_L5.0-W4.0-P1.27-LS6.0-BL]
X1  12MHz ECS-2520MV-120-BN-TR  [OSC-SMD_4P-L2.5-W2.0-BL]

## Library data of the parts
C1-C39 C42 C45 C46 C49 C52 C55 C58 C60 C62 C65 C73 C77 C78 C83 C85 C90-C94 C155 C157 C159 C166 C168 C170 C181-C184 C189-C191 C217-C222 C244 C277-C280 C300 = CAP_0603: Supplier Footprint: 0603
C40 C41 C43 C44 C47 C48 C50 C51 C53 C54 C56 C57 C59 C61 C63 C64 C66-C72 C74-C76 C79-C82 C84 C86-C89 C95-C103 C259 C264 C265 C268 C284-C286 C293-C295 C301-C303 C349-C357 C366-C379 = CAP_0402: Supplier Part: C1525; Supplier Footprint: 0402
R18-R36 R44 R45 R54 R55 R60 R217-R226 R237-R260 = Res_0402: Supplier Footprint: 0402
R1-R16 R37-R43 R61-R65 R69 R70 R72-R74 R124-R131 R270 R271 R278 R279 = Res_0603: Supplier Footprint: 0603
R267 = Res_0201: Supplier Footprint: 0201
U1 U3 = MT41K256M16TW-107:P: Supplier: LCSC; Supplier Part: C253882; Manufacturer: micron(镁光); JLCPCB Part Class: Extended Part; LCSC Part Name: MT41K256M16TW-107:PTR; Supplier Footprint: TFBGA-96; Datasheet: https://atta.szlcsc.com/upload/public/pdf/source/20190702/C253882_073A45851B86D33155EFFA955E523761.pdf
L2-L6 L8-L10 = MH2029-600Y: Impedance @ Frequency:60Ω@100MHz Tolerance:±25% Tolerance:±25% DC Resistance:20mΩ Current Rating:5A Circuits:1; LCSC Part Name: 单路 0805磁珠 阻抗60Ω@100MHz; Supplier Part: C780182; Manufacturer: BOURNS; Supplier Footprint: 0805; JLCPCB Part Class: Extended Part; Datasheet: https://atta.szlcsc.com/upload/public/pdf/source/20200907/C780182_6AA2A849D07FE675FBDEC0D82719ED6E.pdf; Supplier: LCSC; Impedance @ Frequency: 60Ω@100MHz; Tolerance: ±25%; DC Resistance: 20mΩ; Current Rating: 5A; Circuits: 1
L11 = LQM18PN3R3MGHD: Inductance: Tolerance:±20% Tolerance:±20% Rated Current: Saturation Current (Isat): DC Resistance (DCR): Q @ Freq:- Frequency - Self Resonant: Ratings:; LCSC Part Name: 3.3uH ±20% 200mA; Supplier Part: C2046254; Manufacturer: muRata(村田); Supplier Footprint: 0603; JLCPCB Part Class: Extended Part; Datasheet: https://atta.szlcsc.com/upload/public/pdf/source/20190906/C337911_BB1CF2941892ABBD18D947DC76B0377A.pdf; Supplier: LCSC; Tolerance: ±20%
RJ1 = HR911130A: Connector Type:RJ45Receptacle Number of Ports:1 Shielding:- LED:WithLED Ratings:-; LCSC Part Name: 带LED; Supplier Part: C54408; Manufacturer: HANRUN(汉仁); Supplier Footprint: 插件; JLCPCB Part Class: Extended Part; Datasheet: https://atta.szlcsc.com/upload/public/pdf/source/20151014/1457707458393.pdf; Supplier: LCSC; Connector Type: RJ45Receptacle; Number of Ports: 1; LED: WithLED
U35 = RTL8211F-CG: Application Function: Number of Channels: Interface:; LCSC Part Name: 集成10/100/1000M以太网精密收发器; Supplier Part: C187932; Manufacturer: REALTEK(瑞昱); Supplier Footprint: WQFN-40-EP(5x5); JLCPCB Part Class: Extended Part; Datasheet: https://atta.szlcsc.com/upload/public/pdf/source/20190902/C187932_1913F3711F05FE1324DF2946D70D648D.pdf; Supplier: LCSC
U70 = ECS-2520MVQ-250-CN-TR: Frequency:25MHz Output Type:HCMOS Supply Voltage:1.7V~3.6V Supply Voltage:1.7V~3.6V Supply Current (Max):10mA Operating Temperature:-40℃~+85℃ Operating Temperature:-40℃~+85℃; Supplier Part: C2595926; Manufacturer: ECS; Supplier Footprint: SMD2520-4P; JLCPCB Part Class: Extended Part; Datasheet: https://atta.szlcsc.com/upload/public/pdf/source/20210603/E8C40E934CD5FFA13EE846D616DDA70A.pdf; Supplier: LCSC; Output Type: HCMOS; Supply Voltage: 1.7V~3.6V; Supply Current (Max): 10mA; Operating Temperature: -40℃~+85℃
H4 = PZ254V-11-02P: Pin Structure:1x2P Pitch:2.54mm Row Spacing:- Circluar Pins/Square Pins:Square Pins Mounting Type:Straight Number of Rows:Plugin Number of Pins:2P Current Rating (Max):- Voltage Rating (Max):- Length of Mating Pin:6mm Insulation Height:2.5mm Length of End; LCSC Part Name: 间距:2.54mm 1x2P 直插 方针; Supplier Part: C492401; Manufacturer: XFCN(兴飞); Supplier Footprint: 插件,P=2.54mm; JLCPCB Part Class: Extended Part; Datasheet: https://atta.szlcsc.com/upload/public/pdf/source/20200309/C492401_A812433581A9B211A7FFA413ADDFF0E5.pdf; Supplier: LCSC; Pin Structure: 1x2P; Pitch: 2.54mm; Circluar Pins/Square Pins: Square Pins; Mounting Type: Straight; Number of Rows: Plugin; Number of Pins: 2P; Length of Mating Pin: 6mm; Insulation Height: 2.5mm; Length of End Connection Pin: 3mm; Operating Temperature Range: -40℃~+105℃; Color: Black
U28-U31 U71 = Standoff 3.0mm
U64 U65 = Standoff 2.0mm
U79 U80 = T494D476M025AT: Capacitance: Tolerance:±20% Tolerance:±20% Rated Voltage: Leakage Current(DCL):- Ripple Current:- Equivalent Series Resistance(ESR):200mΩ Operating Temperature:-55℃~+125℃ Operating Temperature:-55℃~+125℃; LCSC Part Name: 47uF ±20% 25V; Supplier Part: C1954708; Manufacturer: KEMET(基美); Supplier Footprint: 2917; JLCPCB Part Class: Extended Part; Datasheet: https://atta.szlcsc.com/upload/public/pdf/source/20201117/C918865_2EC2324DB0DED54D3EF2ACC81798626D.pdf; Supplier: LCSC; Tolerance: ±20%; Equivalent Series Resistance(ESR): 200mΩ; Operating Temperature: -55℃~+125℃
C248 = 10TPB330M: Capacitance: Tolerance:±20% Tolerance:±20% Rated Voltage: Equivalent Series Resistance(ESR):35mΩ@100kHz Operating Temperature:-55℃~+105℃ Operating Temperature:-55℃~+105℃; LCSC Part Name: 330uF ±20% 10V; Supplier Part: C347551; Manufacturer: PANASONIC(松下); Supplier Footprint: 2917; JLCPCB Part Class: Extended Part; Datasheet: https://atta.szlcsc.com/upload/public/pdf/source/20190107/C347551_5B2378B09F6036702E6420771D9FA5FD.pdf; Supplier: LCSC; Tolerance: ±20%; Equivalent Series Resistance(ESR): 35mΩ@100kHz; Operating Temperature: -55℃~+105℃
C253 C257 C258 C261-C263 C274 C287-C291 = CA45-B016K156T: LCSC Part Name: 16V ±10% 15μF; Supplier Part: C18185992; Manufacturer: 湘怡中元/湘江; Supplier Footprint: 1210; JLCPCB Part Class: Extended Part; Datasheet: https://atta.szlcsc.com/upload/public/pdf/source/20230919/9477EF3EDFA96363F5057CB80B0E419D.pdf; Supplier: LCSC
C348 = CC1206KRX7RYBB102: Capacitance: Tolerance:±10% Tolerance:±10% Voltage Rated: Temperature Coefficient:; LCSC Part Name: 1nF ±10% 250V; Supplier Part: C107211; Manufacturer: YAGEO(国巨); Supplier Footprint: 1206; JLCPCB Part Class: Extended Part; Datasheet: https://atta.szlcsc.com/upload/public/pdf/source/20180910/C282080_BCE296114B59C3710FB69343383A5C6E.pdf; Supplier: LCSC; Tolerance: ±10%
C380-C404 = CAP_0201: Supplier Footprint: 0201
D8 D13 = PMEG1030EJ,115: Forward Voltage (Vf@If):530mV@3A Reverse Voltage (Vr):10V Average Rectified Current (Io):3A Reverse Leakage Current (Ir):3mA@10V; LCSC Part Name: 电压:10V 电流:3A; Supplier Part: C133633; Manufacturer: Nexperia(安世); Supplier Footprint: SOD-323F; JLCPCB Part Class: Extended Part; Datasheet: https://atta.szlcsc.com/upload/public/pdf/source/20170930/C133633_1506736465007997462.pdf; Supplier: LCSC; Forward Voltage (Vf@If): 530mV@3A; Reverse Voltage (Vr): 10V; Average Rectified Current (Io): 3A; Reverse Leakage Current (Ir): 3mA@10V
DC1 = DC-005_2.0: Supplier Footprint: Through
F2 = PTSLR12106V350
H2 H3 = 2.54-1*3P针: Pin Structure:1x3P Pitch:2.54mm Row Spacing:- Circluar Pins/Square Pins:Square Pins Mounting Type:Straight Number of Rows:Plugin Number of Pins:3P Current Rating (Max):3A Voltage Rating (Max):- Length of Mating Pin:- Insulation Height:- Length of End Conn; LCSC Part Name: 间距:2.54mm 1x3P 直插 方针; Supplier Part: C49257; Manufacturer: BOOMELE(博穆精密); Supplier Footprint: 插件,P=2.54mm; JLCPCB Part Class: Extended Part; Datasheet: https://atta.szlcsc.com/upload/public/pdf/source/20221018/3E9408392E35E6F57A28985E5F7BF5C9.pdf; Supplier: LCSC; Pin Structure: 1x3P; Pitch: 2.54mm; Circluar Pins/Square Pins: Square Pins; Mounting Type: Straight; Number of Rows: Plugin; Number of Pins: 3P; Current Rating (Max): 3A; Operating Temperature Range: -40℃~+105℃; Color: Black
U2 = XC7Z020-1CLG484I: LCSC Part Name: XC7Z020-1CLG484I -; Supplier Part: C89055; Manufacturer: XILINX(赛灵思); Supplier Footprint: BGA-484; JLCPCB Part Class: Extended Part; Datasheet: https://atta.szlcsc.com/upload/public/pdf/source/20180115/C157624_15160149665121269420.pdf; Supplier: LCSC
LED9-LED12 LED18 LED19 = LED_0603-R: Supplier Footprint: 0603
Q1-Q3 Q5 = T2N7002AK,LM: Type:1个NChannel Drain Source Voltage (Vdss):60V Continuous Drain Current (Id): Power Dissipation (Pd): Drain Source On Resistance (RDS(on)@Vgs,Id): Gate Threshold Voltage (Vgs(th)@Id):2.1V@250uA Total Gate Charge (Qg@Vgs):350pC@4.5V Input Capacitance (Cis; LCSC Part Name: 1个N沟道 耐压:60V 电流:200mA; Supplier Part: C516175; Manufacturer: TOSHIBA(东芝); Supplier Footprint: SOT-23; JLCPCB Part Class: Extended Part; Datasheet: https://atta.szlcsc.com/upload/public/pdf/source/20200417/C516175_139D8835A6055C9B9867ECE2E4073B8F.pdf; Supplier: LCSC; Type: 1个NChannel; Drain Source Voltage (Vdss): 60V; Gate Threshold Voltage (Vgs(th)@Id): 2.1V@250uA; Total Gate Charge (Qg@Vgs): 350pC@4.5V; Input Capacitance (Ciss@Vds): 17pF@10V
Q8 = BSH103,215: Type:1个NChannel Drain Source Voltage (Vdss): Continuous Drain Current (Id): Power Dissipation (Pd): Drain Source On Resistance (RDS(on)@Vgs,Id):500mΩ@2.5V,500mA Gate Threshold Voltage (Vgs(th)@Id):400mV@1mA Total Gate Charge (Qg@Vgs):2.1nC@4.5V Input Capa; LCSC Part Name: 1个N沟道 耐压:30V 电流:850mA; Supplier Part: C329197; Manufacturer: Nexperia(安世); Supplier Footprint: TO-236AB; JLCPCB Part Class: Extended Part; Datasheet: https://atta.szlcsc.com/upload/public/pdf/source/20190903/C329197_A7AF21600572FAB3C92E70B456272266.pdf; Supplier: LCSC; Type: 1个NChannel; Drain Source On Resistance (RDS(on)@Vgs,Id): 500mΩ@2.5V,500mA; Gate Threshold Voltage (Vgs(th)@Id): 400mV@1mA; Total Gate Charge (Qg@Vgs): 2.1nC@4.5V; Input Capacitance (Ciss@Vds): 83pF@24V; Operating Temperature: -55℃~+150℃@(Tj)
U4 U6 U8 U10 = TPS56628DDAR: Function:Step-down type Output Type:Adjustable Input Voltage:4.5V~18V Input Voltage:4.5V~18V Output Voltage:765mV~5.5V Output Voltage:765mV~5.5V Output Current (Max):6A Switching Frequency:650kHz Operating Temperature:-40℃~+85℃@(TA) Operating Temperature:; Supplier Part: C485522; Manufacturer: TI(德州仪器); Supplier Footprint: SOIC-8-EP; JLCPCB Part Class: Extended Part; Datasheet: https://www.ti.com/cn/lit/gpn/tps56628; Supplier: LCSC; Function: Step-down type; Output Type: Adjustable; Input Voltage: 4.5V~18V; Output Voltage: 765mV~5.5V; Output Current (Max): 6A; Switching Frequency: 650kHz; Operating Temperature: -40℃~+85℃@(TA); Synchronous Rectification: Yes; Number of Outputs: 1; Topology: Step-down; Switch tube (built-in/external): 内置
U37-U40 = INPAQ AIP0530GX Series
U68 = BD3539FVM-TR: Supplier: LCSC; Supplier Part: C213437; Manufacturer: ROHM(罗姆); JLCPCB Part Class: Extended Part; Supplier Footprint: MSOP-8-2.8mm; Datasheet: https://atta.szlcsc.com/upload/public/pdf/source/20220628/C3441D905FB45889994490DDF4CAADF0.pdf
D6 D7 = Zener Diode
F1 = 1206L050/15YR: Operating Voltage (Max):15V Current Rating (Max):100A Hold Current:500mA Trip Current:1A Power Dissipation:- Resistance - Initial (Ri) (Min):150mΩ Resistance - Post Trip (R1) (Max):750mΩ Maximum Time to Trip:100ms Operating Temperature:-40℃~+85℃ Operating; LCSC Part Name: 15V 500mA 1206自恢复; Supplier Part: C151162; Manufacturer: Littelfuse(美国力特); Supplier Footprint: 1206; JLCPCB Part Class: Extended Part; Datasheet: https://atta.szlcsc.com/upload/public/pdf/source/20181031/C315893_583812352E070A3E75892B744443DEDE.pdf; Supplier: LCSC; Operating Voltage (Max): 15V; Current Rating (Max): 100A; Hold Current: 500mA; Trip Current: 1A; Resistance - Initial (Ri) (Min): 150mΩ; Resistance - Post Trip (R1) (Max): 750mΩ; Maximum Time to Trip: 100ms; Operating Temperature: -40℃~+85℃
LED15 LED16 = LED_0603-G
U27 = GT-USB-7010ASV: Connector Type:Type-C Standard:USB 2.0 Gender:Female Number of Ports:1 Number of Contacts:16P Mounting Style:卧贴 Current Rating - Power (Max):3A Contact Material:高导铜 Contact Plating:Gold Operating Temperature Range:-40℃~+85℃ Operating Temperature Range:-40; LCSC Part Name: Type-C 母 卧贴; Supplier Part: C2988369; Manufacturer: G-Switch(品赞); Supplier Footprint: SMD; JLCPCB Part Class: Extended Part; Datasheet: https://atta.szlcsc.com/upload/public/pdf/source/20230327/DF227B64686AC8FA0AD1775797F2C3F1.pdf; Supplier: LCSC; Connector Type: Type-C; Standard: USB 2.0; Gender: Female; Number of Ports: 1; Number of Contacts: 16P; Mounting Style: 卧贴; Current Rating - Power (Max): 3A; Contact Material: 高导铜; Contact Plating: Gold; Operating Temperature Range: -40℃~+85℃; Soldering Temperature(Max): 260℃
U34 = FT2232HL-REEL: Applications Function:USB转UART；USB转FIFO Protocol:UART Supply Voltage:3V~3.6V Supply Voltage:3V~3.6V Operating Temperature:-40℃~+85℃ Operating Temperature:-40℃~+85℃; LCSC Part Name: USB到串行/FIFO; Supplier Part: C27882; Manufacturer: FTDI(飞特帝亚); Supplier Footprint: LQFP-64(10x10); JLCPCB Part Class: Extended Part; Datasheet: https://atta.szlcsc.com/upload/public/pdf/source/20140319/1457707024994.pdf; Supplier: LCSC; Applications Function: USB转UART；USB转FIFO; Protocol: UART; Supply Voltage: 3V~3.6V; Operating Temperature: -40℃~+85℃
U60 = 93LC56B-I/SN: Interface Type:SPI Memory Size:2Kbit Supply Voltage:2.5V~5.5V Supply Voltage:2.5V~5.5V Operating Temperature:-40℃~+85℃ Operating Temperature:-40℃~+85℃; Supplier Part: C183620; Manufacturer: MICROCHIP(美国微芯); Supplier Footprint: SOIC-8; JLCPCB Part Class: Extended Part; Datasheet: https://atta.szlcsc.com/upload/public/pdf/source/20140724/1457707164359.pdf; Supplier: LCSC; Interface Type: SPI; Memory Size: 2Kbit; Supply Voltage: 2.5V~5.5V; Operating Temperature: -40℃~+85℃
X1 = ECS-2520MV-120-BN-TR: Frequency:12MHz Output Type:HCMOS Supply Voltage:1.6V~3.6V Supply Voltage:1.6V~3.6V Supply Current (Max):6mA Frequency Stability(Full temperature range):±50ppm Frequency Stability(Full temperature range):±50ppm Operating Temperature:-40℃~+85℃ Operating Te; Supplier Part: C405460; Manufacturer: ECS; Supplier Footprint: SMD2520-4P; JLCPCB Part Class: Extended Part; Datasheet: https://atta.szlcsc.com/upload/public/pdf/source/20190722/C405472_2FCB2E02432CF0A2EC5ED9723E17E19C.pdf; Supplier: LCSC; Output Type: HCMOS; Supply Voltage: 1.6V~3.6V; Supply Current (Max): 6mA; Frequency Stability(Full temperature range): ±50ppm; Operating Temperature: -40℃~+85℃

## Nets
0V675: C40.1 C41.1 C43.1 C44.1 C72.1 C74.1 C75.1 C76.1 C90.1 C91.1 C92.1 C93.1 C220.1 C221.1 R18.2 R19.2 R20.2 R21.2 R22.2 R23.2 R24.2 R25.2 R26.2 R27.2 R28.2 R29.2 R30.2 R31.2 R32.2 R33.2 R34.2 R35.2 R36.2 R44.2 R45.2 R54.2 R55.2 R60.2 R127.2 U68.3(VTTS) U68.8(VTT)
0V675_EN: R124.1 R125.2 U68.2(EN)
0V675_REF: C6.2 C35.2 C36.1 C37.1 C38.1 C39.1 C222.1 U1.H1(VREFDQ) U1.M8(VREFCA) U2.H7(PS_DDR_VREF0_502) U2.P7(PS_DDR_VREF1_502) U3.H1(VREFDQ) U3.M8(VREFCA) U68.4(VREF)
0V675_VDDQ: R130.1 U68.5(VDDQ)
1V0: C29.2 C32.1 C33.1 C73.1 C78.1 C244.1 C248.1 C253.1 C279.1 C289.1 C380.1 C381.1 C382.1 C383.1 C392.1 C393.1 C400.1 C402.1 R14.2 U2.G8(VCCPINT) U2.H9(VCCPINT) U2.H11(VCCBRAM) U2.J8(VCCPINT) U2.J10(VCCBRAM) U2.J12(VCCINT) U2.J14(VCCINT) U2.K13(VCCINT) U2.L8(VCCPINT) U2.L14(VCCINT) U2.M13(VCCINT) U2.N8(VCCPINT) U2.N14(VCCINT) U2.P13(VCCINT) U2.R8(VCCPINT) U2.R14(VCCINT) U37.2
1V0_EN: R13.1 U10.1(EN)
1V0_ETH: C170.1 C366.1 C367.1 C368.1 C374.1 C379.1 L11.2 U35.3(AVDD10) U35.8(AVDD10) U35.21(DVDD10) U35.38(AVDD10)
1V0_FB: C29.1 R14.1 R15.1 U10.2(VFB)
1V8: C13.2 C16.1 C17.1 C85.1 C157.1 C258.1 C274.1 C277.1 C278.1 C287.1 C372.1 C384.1 C385.1 C389.1 C390.1 C391.1 L2.1 L4.2 L5.2 R6.2 U2.A10(VCCO_MIO1_501) U2.B13(VCCO_MIO1_501) U2.D9(VCCO_MIO1_501) U2.E12(VCCO_MIO1_501) U2.G9(VCCBATT_0) U2.K9(VCCPAUX) U2.L10(VCCAUX) U2.M9(VCCPAUX) U2.N10(VCCAUX) U2.P9(VCCPAUX) U2.P11(VCCAUX) U2.R10(VCCAUX) U2.T9(VCCPAUX) U38.2 ; also on sheet 7 12 13
1V8_ETH: C155.1 C369.1 C371.1 C373.1 L5.1 R245.1 R246.1 R251.1 R252.1 R253.1 R254.1 U35.28(DVDD_RG) U70.1(Tri-state) U70.4(Vdd)
1V8_FTDI: C184.1 C351.1 C352.1 C353.1 U34.12(VCORE) U34.37(VCORE) U34.49(VREGOUT) U34.64(VCORE)
1V8ADC: C302.1 C303.1 C404.1 L2.2 U2.K11(VCCADC_0)
1V35: C6.1 C21.2 C24.1 C25.1 C35.1 C46.1 C47.1 C48.1 C50.1 C51.1 C53.1 C54.1 C56.1 C57.1 C59.1 C60.1 C61.1 C63.1 C64.1 C66.1 C67.1 C68.1 C69.1 C70.1 C71.1 C77.1 C79.1 C80.1 C81.1 C82.1 C84.1 C86.1 C87.1 C88.1 C89.1 C94.1 C95.1 C96.1 C97.1 C98.1 C99.1 C100.1 C101.1 C102.1 C103.1 C218.1 C280.1 C284.1 C285.1 C286.1 C288.1 C403.1 R10.2 R64.2 R130.2 U1.A1(VDDQ) U1.A8(VDDQ) U1.B2(VDD) U1.C1(VDDQ) U1.C9(VDDQ) U1.D2(VDDQ) U1.D9(VDD) U1.E9(VDDQ) U1.F1(VDDQ) U1.G7(VDD) U1.H2(VDDQ) U1.H9(VDDQ) U1.K2(VDD) U1.K8(VDD) U1.N1(VDD) U1.N9(VDD) U1.R1(VDD) U1.R9(VDD) U2.E2(VCCO_DDR_502) U2.F5(VCCO_DDR_502) U2.H1(VCCO_DDR_502) U2.J4(VCCO_DDR_502) U2.K7(VCCO_DDR_502) U2.M3(VCCO_DDR_502) U2.N6(VCCO_DDR_502) U2.R2(VCCO_DDR_502) U2.V1(VCCO_DDR_502) U3.A1(VDDQ) U3.A8(VDDQ) U3.B2(VDD) U3.C1(VDDQ) U3.C9(VDDQ) U3.D2(VDDQ) U3.D9(VDD) U3.E9(VDDQ) U3.F1(VDDQ) U3.G7(VDD) U3.H2(VDDQ) U3.H9(VDDQ) U3.K2(VDD) U3.K8(VDD) U3.N1(VDD) U3.N9(VDD) U3.R1(VDD) U3.R9(VDD) U39.2
1V35_EN: R9.1 U8.1(EN)
1V35_SW: C23.2 U8.6(SW) U39.1
1V35_VBST: C23.1 U8.7(VBST)
1V35_VFB: C21.1 R10.1 R11.1 U8.2(VFB)
1V35_VREG5: C22.1 R12.1 U8.3(VREG5)
3V3: C4.2 C8.1 C9.1 C42.1 C45.1 C49.1 C52.1 C55.1 C58.1 C62.1 C65.1 C83.1 C159.1 C168.1 C183.1 C190.1 C191.1 C257.1 C259.1 C261.1 C262.1 C263.1 C264.1 C265.1 C268.1 C290.1 C291.1 C293.1 C294.1 C295.1 C354.1 C355.1 C356.1 C357.1 C370.1 C378.1 C386.1 C387.1 C388.1 C394.1 C395.1 C396.1 C397.1 C398.1 C399.1 C401.1 L6.2 L8.1 L10.1 R1.2 R73.1 R224.2 R225.2 R240.1 R241.1 R278.1 R279.1 RJ1.11 RJ1.14 U2.A20(VCCO_35) U2.AA10(VCCO_13) U2.AA20(VCCO_33) U2.AB3(VCCO_13) U2.AB13(VCCO_33) U2.B3(VCCO_MIO0_500) U2.C6(VCCO_MIO0_500) U2.C16(VCCO_35) U2.D19(VCCO_35) U2.E22(VCCO_35) U2.F15(VCCO_35) U2.G18(VCCO_35) U2.H21(VCCO_35) U2.K17(VCCO_34) U2.L20(VCCO_34) U2.N16(VCCO_34) U2.P19(VCCO_34) U2.R12(VCCO_0) U2.R22(VCCO_34) U2.T5(VCCO_13) U2.T7(RSVDVCC1) U2.T8(RSVDVCC2) U2.T10(RSVDVCC3) U2.T15(VCCO_34) U2.U8(VCCO_13) U2.U18(VCCO_33) U2.V11(VCCO_13) U2.V21(VCCO_33) U2.W4(VCCO_13) U2.W14(VCCO_33) U2.Y7(VCCO_13) U2.Y17(VCCO_33) U34.20(VCCIO) U34.21(ADBUS4) U34.31(VCCIO) U34.42(VCCIO) U34.50(VREGIN) U34.56(VCCIO) U35.29(DVDD33) U40.2 U60.8(VCC) X1.1(Tri-state) X1.4(Vdd) ; also on sheet 7 8 9 10 11 12 13
3V3_ETH: C166.1 C375.1 C376.1 C377.1 L6.1 U35.11(AVDD33) U35.40(AVDD33)
5V0: C1.1 C2.1 C3.1 C10.1 C11.1 C12.1 C18.1 C19.1 C20.1 C26.1 C27.1 C28.1 C217.1 C219.1 D8.1(K) H2.2 H3.2 H4.1 R13.2 R37.2 R39.2 R40.2 R42.2 R126.2 R128.2 U4.8(VIN) U6.8(VIN) U8.8(VIN) U10.8(VIN) U68.6(VCC) U68.7(VTT_IN) U79.1 U80.1 ; also on sheet 7 8 9 13
5V0EXT: F2.2 H2.1 H3.1
AGND: C302.2 C303.2 C404.2 L3.2 U2.K12(GNDADC_0)
GND: C1.2 C2.2 C3.2 C5.2 C8.2 C9.2 C10.2 C11.2 C12.2 C14.2 C16.2 C17.2 C18.2 C19.2 C20.2 C22.2 C24.2 C25.2 C26.2 C27.2 C28.2 C30.2 C32.2 C33.2 C34.2 C36.2 C37.2 C38.2 C39.2 C40.2 C41.2 C42.2 C43.2 C44.2 C45.2 C46.2 C47.2 C48.2 C49.2 C50.2 C51.2 C52.2 C53.2 C54.2 C55.2 C56.2 C57.2 C58.2 C59.2 C60.2 C61.2 C62.2 C63.2 C64.2 C65.2 C66.2 C67.2 C68.2 C69.2 C70.2 C71.2 C72.2 C73.2 C74.2 C75.2 C76.2 C77.2 C78.2 C79.2 C80.2 C81.2 C82.2 C83.2 C84.2 C85.2 C86.2 C87.2 C88.2 C89.2 C90.2 C91.2 C92.2 C93.2 C94.2 C95.2 C96.2 C97.2 C98.2 C99.2 C100.2 C101.2 C102.2 C103.2 C155.2 C157.2 C159.2 C166.2 C168.2 C170.2 C181.2 C182.2 C183.2 C184.2 C189.2 C190.2 C191.2 C217.2 C218.2 C219.2 C220.2 C221.2 C222.2 C244.2 C248.2 C253.2 C257.2 C258.2 C259.2 C261.2 C262.2 C263.2 C264.2 C265.2 C268.2 C274.2 C277.2 C278.2 C279.2 C280.2 C284.2 C285.2 C286.2 C287.2 C288.2 C289.2 C290.2 C291.2 C293.2 C294.2 C295.2 C300.1 C301.2 C348.2 C349.2 C350.2 C351.2 C352.2 C353.2 C354.2 C355.2 C356.2 C357.2 C366.2 C367.2 C368.2 C369.2 C370.2 C371.2 C372.2 C373.2 C374.2 C375.2 C376.2 C377.2 C378.2 C379.2 C380.2 C381.2 C382.2 C383.2 C384.2 C385.2 C386.2 C387.2 C388.2 C389.2 C390.2 C391.2 C392.2 C393.2 C394.2 C395.2 C396.2 C397.2 C398.2 C399.2 C400.2 C401.2 C402.2 C403.2 D6.1 D7.1 DC1.2 DC1.3 H4.2 L3.1 LED10.2(C) Q1.2(S) Q2.2(S) Q3.2(S) Q5.2(S) Q8.2(S) R2.2 R7.2 R11.2 R15.2 R61.1 R62.1 R63.1 R65.1 R70.1 R125.1 R131.2 R226.1 R239.1 R244.2 R247.2 R248.2 R249.2 R250.2 RJ1.P10 U1.A9(VSS) U1.B1(VSSQ) U1.B3(VSS) U1.B9(VSSQ) U1.D1(VSSQ) U1.D8(VSSQ) U1.E1(VSS) U1.E2(VSSQ) U1.E8(VSSQ) U1.F9(VSSQ) U1.G1(VSSQ) U1.G8(VSS) U1.G9(VSSQ) U1.J2(VSS) U1.J8(VSS) U1.M1(VSS) U1.M9(VSS) U1.P1(VSS) U1.P9(VSS) U1.T1(VSS) U1.T9(VSS) U2.A5(GND) U2.A15(GND) U2.AA5(GND) U2.AA15(GND) U2.AB8(GND) U2.AB18(GND) U2.B8(GND) U2.B18(GND) U2.C1(GND) U2.C11(GND) U2.C21(GND) U2.D4(GND) U2.D14(GND) U2.E7(GND) U2.E17(GND) U2.F10(GND) U2.F20(GND) U2.G3(GND) U2.H6(GND) U2.H8(GND) U2.H12(GND) U2.H14(GND) U2.H16(GND) U2.J9(GND) U2.J11(GND) U2.J13(GND) U2.J19(GND) U2.K2(GND) U2.K8(GND) U2.K10(GND) U2.K14(GND) U2.K22(GND) U2.L5(GND) U2.L9(GND) U2.L13(GND) U2.L15(GND) U2.M8(GND) U2.M10(GND) U2.M14(GND) U2.M18(GND) U2.N1(GND) U2.N9(GND) U2.N13(GND) U2.N21(GND) U2.P4(GND) U2.P8(GND) U2.P10(GND) U2.P12(GND) U2.P14(GND) U2.R9(GND) U2.R11(GND) U2.R13(GND) U2.R17(GND) U2.T20(GND) U2.U3(GND) U2.U13(GND) U2.V6(GND) U2.V16(GND) U2.W9(GND) U2.W19(GND) U2.Y2(GND) U2.Y12(GND) U2.Y22(GND) U3.A9(VSS) U3.B1(VSSQ) U3.B3(VSS) U3.B9(VSSQ) U3.D1(VSSQ) U3.D8(VSSQ) U3.E1(VSS) U3.E2(VSSQ) U3.E8(VSSQ) U3.F9(VSSQ) U3.G1(VSSQ) U3.G8(VSS) U3.G9(VSSQ) U3.J2(VSS) U3.J8(VSS) U3.M1(VSS) U3.M9(VSS) U3.P1(VSS) U3.P9(VSS) U3.T1(VSS) U3.T9(VSS) U4.5(GND) U4.9(GND) U6.5(GND) U6.9(GND) U8.5(GND) U8.9(GND) U10.5(GND) U10.9(GND) U27.A1B12(GND) U27.B1A12(GND) U28.1 U29.1 U30.1 U31.1 U34.1(GND) U34.5(GND) U34.10(AGND) U34.11(GND) U34.13(TEST) U34.15(GND) U34.25(GND) U34.35(GND) U34.47(GND) U34.51(GND) U35.41(GND) U60.5(VSS) U64.1 U65.1 U68.1(GND) U70.2(GND) U79.2 U80.2 X1.2(Gnd) ; also on sheet 7 8 9 11 12 13
VCCPLL: C300.2 C301.1 L4.1 U2.H10(VCCPLL)
CHASSIS_GND: C348.1 R131.1 RJ1.SHIELD0 RJ1.SHIELD1 U27.1(SHELL) U27.2(SHELL) U27.3(SHELL) U27.4(SHELL) U71.1 ; also on sheet 9 12 13
DC_IN: D13.2(A) DC1.4
DDR_ADDR0: R28.1 U1.N3(A0) U2.M4(PS_DDR_A0_502) U3.N3(A0)
DDR_ADDR1: R27.1 U1.P7(A1) U2.M5(PS_DDR_A1_502) U3.P7(A1)
DDR_ADDR2: R26.1 U1.P3(A2) U2.K4(PS_DDR_A2_502) U3.P3(A2)
DDR_ADDR3: R31.1 U1.N2(A3) U2.L4(PS_DDR_A3_502) U3.N2(A3)
DDR_ADDR4: R30.1 U1.P8(A4) U2.K6(PS_DDR_A4_502) U3.P8(A4)
DDR_ADDR5: R29.1 U1.P2(A5) U2.K5(PS_DDR_A5_502) U3.P2(A5)
DDR_ADDR6: R34.1 U1.R8(A6) U2.J7(PS_DDR_A6_502) U3.R8(A6)
DDR_ADDR7: R33.1 U1.R2(A7) U2.J6(PS_DDR_A7_502) U3.R2(A7)
DDR_ADDR8: R32.1 U1.T8(A8) U2.J5(PS_DDR_A8_502) U3.T8(A8)
DDR_ADDR9: R44.1 U1.R3(A9) U2.H5(PS_DDR_A9_502) U3.R3(A9)
DDR_ADDR10: R36.1 U1.L7(A10/AP) U2.J3(PS_DDR_A10_502) U3.L7(A10/AP)
DDR_ADDR11: R35.1 U1.R7(A11) U2.G5(PS_DDR_A11_502) U3.R7(A11)
DDR_ADDR12: R55.1 U1.N7(A12/BC#) U2.H4(PS_DDR_A12_502) U3.N7(A12/BC#)
DDR_ADDR13: R54.1 U1.T3(A13) U2.F4(PS_DDR_A13_502) U3.T3(A13)
DDR_ADDR14: R45.1 U1.T7(A14) U2.G4(PS_DDR_A14_502) U3.T7(A14)
DDR_BA0: R25.1 U1.M2(BA0) U2.L7(PS_DDR_BA0_502) U3.M2(BA0)
DDR_BA1: R24.1 U1.N8(BA1) U2.L6(PS_DDR_BA1_502) U3.N8(BA1)
DDR_BA2: R23.1 U1.M3(BA2) U2.M6(PS_DDR_BA2_502) U3.M3(BA2)
DDR_CASB: R20.1 U1.K3(CAS#) U2.P3(PS_DDR_CAS_B_502) U3.K3(CAS#)
DDR_CK_N: R267.2 U1.K7(CK#) U2.N5(PS_DDR_CKN_502) U3.K7(CK#)
DDR_CK_P: R267.1 U1.J7(CK) U2.N4(PS_DDR_CKP_502) U3.J7(CK)
DDR_CKE: R18.1 U1.K9(CKE) U2.V3(PS_DDR_CKE_502) U3.K9(CKE)
DDR_CSB: R22.1 U1.L2(CS#) U2.P6(PS_DDR_CS_B_502) U3.L2(CS#)
DDR_DM0: U1.E7(LDM) U2.B1(PS_DDR_DM0_502)
DDR_DM1: U1.D3(UDM) U2.H3(PS_DDR_DM1_502)
DDR_DM2: U2.P1(PS_DDR_DM2_502) U3.E7(LDM)
DDR_DM3: U2.AA2(PS_DDR_DM3_502) U3.D3(UDM)
DDR_DQ0: U1.E3(DQ0) U2.D1(PS_DDR_DQ0_502)
DDR_DQ1: U1.F7(DQ1) U2.E1(PS_DDR_DQ5_502)
DDR_DQ2: U1.F2(DQ2) U2.B2(PS_DDR_DQ2_502)
DDR_DQ3: U1.F8(DQ3) U2.F2(PS_DDR_DQ6_502)
DDR_DQ4: U1.H3(DQ4) U2.D3(PS_DDR_DQ3_502)
DDR_DQ5: U1.H8(DQ5) U2.E3(PS_DDR_DQ4_502)
DDR_DQ6: U1.G2(DQ6) U2.C3(PS_DDR_DQ1_502)
DDR_DQ7: U1.H7(DQ7) U2.F1(PS_DDR_DQ7_502)
DDR_DQ8: U1.D7(DQ8) U2.G2(PS_DDR_DQ8_502)
DDR_DQ9: U1.C3(DQ9) U2.L1(PS_DDR_DQ10_502)
DDR_DQ10: U1.C8(DQ10) U2.L3(PS_DDR_DQ12_502)
DDR_DQ11: U1.C2(DQ11) U2.L2(PS_DDR_DQ11_502)
DDR_DQ12: U1.A7(DQ12) U2.J1(PS_DDR_DQ14_502)
DDR_DQ13: U1.A2(DQ13) U2.K3(PS_DDR_DQ15_502)
DDR_DQ14: U1.B8(DQ14) U2.K1(PS_DDR_DQ13_502)
DDR_DQ15: U1.A3(DQ15) U2.G1(PS_DDR_DQ9_502)
DDR_DQ16: U2.M1(PS_DDR_DQ16_502) U3.E3(DQ0)
DDR_DQ17: U2.R3(PS_DDR_DQ20_502) U3.F7(DQ1)
DDR_DQ18: U2.R1(PS_DDR_DQ23_502) U3.F2(DQ2)
DDR_DQ19: U2.T2(PS_DDR_DQ21_502) U3.F8(DQ3)
DDR_DQ20: U2.T1(PS_DDR_DQ19_502) U3.H3(DQ4)
DDR_DQ21: U2.T3(PS_DDR_DQ17_502) U3.H8(DQ5)
DDR_DQ22: U2.N3(PS_DDR_DQ18_502) U3.G2(DQ6)
DDR_DQ23: U2.M2(PS_DDR_DQ22_502) U3.H7(DQ7)
DDR_DQ24: U2.AA3(PS_DDR_DQ24_502) U3.D7(DQ8)
DDR_DQ25: U2.Y3(PS_DDR_DQ29_502) U3.C3(DQ9)
DDR_DQ26: U2.W1(PS_DDR_DQ28_502) U3.C8(DQ10)
DDR_DQ27: U2.U2(PS_DDR_DQ27_502) U3.C2(DQ11)
DDR_DQ28: U2.Y1(PS_DDR_DQ31_502) U3.A7(DQ12)
DDR_DQ29: U2.U1(PS_DDR_DQ25_502) U3.A2(DQ13)
DDR_DQ30: U2.W3(PS_DDR_DQ30_502) U3.B8(DQ14)
DDR_DQ31: U2.AA1(PS_DDR_DQ26_502) U3.A3(DQ15)
DDR_DQS0_N: U1.G3(LDQS#) U2.D2(PS_DDR_DQS_N0_502)
DDR_DQS0_P: U1.F3(LDQS) U2.C2(PS_DDR_DQS_P0_502)
DDR_DQS1_N: U1.B7(UDQS#) U2.J2(PS_DDR_DQS_N1_502)
DDR_DQS1_P: U1.C7(UDQS) U2.H2(PS_DDR_DQS_P1_502)
DDR_DQS2_N: U2.P2(PS_DDR_DQS_N2_502) U3.G3(LDQS#)
DDR_DQS2_P: U2.N2(PS_DDR_DQS_P2_502) U3.F3(LDQS)
DDR_DQS3_N: U2.W2(PS_DDR_DQS_N3_502) U3.B7(UDQS#)
DDR_DQS3_P: U2.V2(PS_DDR_DQS_P3_502) U3.C7(UDQS)
DDR_ODT: R60.1 U1.K1(ODT) U2.P5(PS_DDR_ODT_502) U3.K1(ODT)
DDR_RASB: R21.1 U1.J3(RAS#) U2.R5(PS_DDR_RAS_B_502) U3.J3(RAS#)
DDR_RSTB: R63.2 U1.T2(RESET#) U2.F3(PS_DDR_DRST_B_502) U3.T2(RESET#)
DDR_WEB: R19.1 U1.L3(WE#) U2.R4(PS_DDR_WE_B_502) U3.L3(WE#)
DN1: D7.2 U27.A7(DN1) U34.7(DM)
DP1: D6.2 U27.A6(DP1) U34.8(DP)
ETH_CLK_25MHZ: R242.1 U35.37(XTAL_OUT/EXT_CLK)
ETH_CLKO: R243.1 U35.35(CLKOUT)
ETH_INTB: R245.2 U35.31(INTB/PMEB) ; also on sheet 7
ETH_MDC: U35.13(MDC) ; also on sheet 7
ETH_MDIO: R246.2 U35.14(MDIO) ; also on sheet 7
ETH_PHY_RXCLK: R260.2 U35.27(PHYAD1/RXC)
ETH_PHY_RXCTL: R259.2 U35.26(PHYAD2/RXCTL)
ETH_PHY_RXD0: R255.2 U35.25(RXDLY/RXD0)
ETH_PHY_RXD1: R256.2 U35.24(TXDLY/RXD1)
ETH_PHY_RXD2: R257.2 U35.23(PLLOFF/RXD2)
ETH_PHY_RXD3: R258.2 U35.22(PHYAD0/RXD3)
ETH_PHY_TXCLK: U35.20(TXC) ; also on sheet 7
ETH_PHY_TXCTL: U35.19(TXCTL) ; also on sheet 7
ETH_PHY_TXD0: U35.18(TXD0) ; also on sheet 7
ETH_PHY_TXD1: U35.17(TXD1) ; also on sheet 7
ETH_PHY_TXD2: U35.16(TXD2) ; also on sheet 7
ETH_PHY_TXD3: U35.15(TXD3) ; also on sheet 7
ETH_REG_OUT: L11.1 U35.30(REG_OUT/LDO_OUT)
ETH_RSET: R250.1 U35.39(RSET)
ETH_RSTB: U35.12(PHYRSTB) ; also on sheet 7
ETH_RXCLK: R248.1 R260.1 ; also on sheet 7
ETH_RXCTL: R247.1 R259.1 ; also on sheet 7
ETH_RXD0: R251.2 R255.1 ; also on sheet 7
ETH_RXD1: R252.2 R256.1 ; also on sheet 7
ETH_RXD2: R249.1 R253.2 R257.1 ; also on sheet 7
ETH_RXD3: R254.2 R258.1 ; also on sheet 7
ETH_XTAL_IN: R244.1 U35.36(XTAL_IN)
FTDI_RX_LED: LED16.1(C) U34.55(BCBUS4)
FTDI_TX_LED: LED15.1(C) U34.54(BCBUS3)
MDI0_N: RJ1.P3(MDI0-) U35.2(MDIN0)
MDI0_P: RJ1.P2(MDI0+) U35.1(MDIP0)
MDI1_N: RJ1.P7(MDI1-) U35.5(MDIN1)
MDI1_P: RJ1.P4(MDI1+) U35.4(MDIP1)
MDI2_N: RJ1.P6(MDI2-) U35.7(MDIN2)
MDI2_P: RJ1.P5(MDI2+) U35.6(MDIP2)
MDI3_N: RJ1.P9(MDI3-) U35.10(MDIN3)
MDI3_P: RJ1.P8(MDI3+) U35.9(MDIP3)
PG_1V0: R5.2 R16.2 R41.2 U10.4(PG)
PG_1V8: R8.2 R9.2 R43.2 U6.4(PG)
PG_1V35: R3.2 R12.2 R38.2 R124.2 U8.4(PG)
PG_3V3: R4.2 R129.2 U4.4(PG) ; also on sheet 7
PL_CLK_125MHZ: R243.2 ; also on sheet 10
TCK: R217.2 ; also on sheet 8
TDI: R218.2 ; also on sheet 8
TDO: R219.2 ; also on sheet 8
TMS: R220.2 ; also on sheet 8
UART1_RX: R270.2 ; also on sheet 7
UART1_TX_VCFG1: R271.2 ; also on sheet 7
VUSB: C181.1 F1.2 H2.3 H3.3 L9.1
VUSB_IN: F1.1 U27.A4B9(VBUS) U27.B4A9(VBUS)
~PS_POR: R221.2 ; also on sheet 7
$2N1143: R3.1 U4.1(EN)
$2N1312: C4.1 R1.1 R2.1 U4.2(VFB)
$2N1509: C5.1 R4.1 U4.3(VREG5)
$2N1578: C7.1 U4.7(VBST)
$2N1646: C7.2 U4.6(SW) U40.1
$2N2331: R5.1 U6.1(EN)
$2N2339: C13.1 R6.1 R7.1 U6.2(VFB)
$2N2348: C14.1 R8.1 U6.3(VREG5)
$2N2356: C15.1 U6.7(VBST)
$2N2360: C15.2 U6.6(SW) U38.1
$2N3340: C30.1 R16.1 U10.3(VREG5)
$2N3348: C31.1 U10.7(VBST)
$2N3352: C31.2 U10.6(SW) U37.1
$2N17251: LED9.1(A) R37.1
$2N17253: Q2.1(G) R38.1
$2N17254: LED9.2(C) Q2.3(D)
$2N17328: LED10.1(A) R39.1
$2N17476: LED11.1(A) R40.1
$2N17478: Q1.1(G) R41.1
$2N17479: LED11.2(C) Q1.3(D)
$2N17618: LED12.1(A) R42.1
$2N17620: Q3.1(G) R43.1
$2N17621: LED12.2(C) Q3.3(D)
$2N21591: LED18.1(A) R126.1
$2N21594: LED18.2(C) Q8.3(D)
$2N21723: LED19.1(A) R128.1
$2N21725: Q5.1(G) R129.1
$2N21726: LED19.2(C) Q5.3(D)
$2N30594: Q8.1(G) R127.1
$3N6551: D13.1(K) F2.1
$4N8180: R65.2 U2.M7(PS_DDR_VRN_502)
$4N8222: R64.1 U2.N7(PS_DDR_VRP_502)
$4N10654: R61.2 U1.L8(ZQ)
$4N10748: R62.2 U3.L8(ZQ)
$5N2490: R217.1 U34.16(ADBUS0)
$5N2492: R218.1 U34.17(ADBUS1)
$5N2494: R219.1 U34.18(ADBUS2)
$5N2496: R220.1 U34.19(ADBUS3)
$5N2542: R221.1 U34.22(ADBUS5)
$5N2610: R222.1 U34.38(BDBUS0)
$5N2612: R223.1 U34.39(BDBUS1)
$5N2814: LED15.2(A) R225.1
$5N2818: LED16.2(A) R224.1
$5N3117: R226.2 U34.6(REF)
$5N3210: C182.1 D8.2(A) L9.2 R69.2
$5N3711: R69.1 R70.2 U34.14(RESET#)
$5N4260: C34.1 C349.1 L10.2 U34.9(VPLL)
$5N4365: C189.1 C350.1 L8.2 U34.4(VPHY)
$5N4486: R279.2 U34.63(EECS) U60.1(CS)
$5N4493: R278.2 U34.62(EECLK) U60.2(CLK)
$5N4765: R74.1 U34.2(OSCI)
$5N4768: R74.2 X1.3(Output)
$5N9559: R222.2 R270.1
$5N9562: R223.2 R271.1
$5N10376: R72.1 U34.61(EEDATA) U60.3(DI)
$5N10400: R72.2 R73.2 U60.4(DO)
$6N3816: R242.2 U70.3(Output)
$6N4341: R239.2 U35.33(CFG_LDO0/LED1)
$6N4502: R237.1 R240.2 U35.32(CFG_EXT/LED0)
$6N4509: R238.1 R241.2 U35.34(CFG_LDO1/LED2)
$6N4516: R237.2 RJ1.12
$6N4610: R238.2 RJ1.13

Not connected (* = marked no-connect by the designer): RJ1 P1*; U1 J1(NC)* J9(NC)* L1(NC)* L9(NC)* M7(NC)*; U2 G10(RSVDGND)*; U3 J1(NC)* J9(NC)* L1(NC)* L9(NC)* M7(NC)*; U27 A5(CC1)* A8(SBU1)* B5(CC2)* B6(DP2)* B7(DN2)* B8(SBU2)*; U34 3(OSCO)* 23(ADBUS6)* 24(ADBUS7)* 26(ACBUS0)* 27(ACBUS1)* 28(ACBUS2)* 29(ACBUS3)* 30(ACBUS4)* 32(ACBUS5)* 33(ACBUS6)* 34(ACBUS7)* 36(SUSPEND#)* 40(BDBUS2)* 41(BDBUS3)* 43(BDBUS4)* 44(BDBUS5)* 45(BDBUS6)* 46(BDBUS7)* 48(BCBUS0)* 52(BCBUS1)* 53(BCBUS2)* 57(BCBUS5)* 58(BCBUS6)* 59(BCBUS7)* 60(PWREN#)*; U60 6(ORG*)* 7(NC)*

## Notes on the sheets
sheet 1
- To do:
  -Lots of schematic clean-up! Posting for now for those interested.
  -Update board routing based on minor schematic changes since the board production.
- To do:
  -power off sequencing
  -0.675 power indicator design (different mosfet for lower voltage?)
  -Programming header HS3 should be 2.0mm instead of 2.54mm
  -Move R267 from DDR to closer to SoC
  -Move C193 closer to U61
  -Incorrect part # on 33MHz oscillator - installed 25MHz for now
  -Additional oscillator for FPGA fabric (without Eth IC)?
  -Power header for 3.3V
  -Onboard LED for PL
  -Onboard buttones for PS and PL
  -Power rail selection jumpers don't seem to be needed. Always leave set to external DC barrel power.
  -Improve Ethernet reset circuit?
  -Add in HDMI controller (ADV7513?)
  -Power coming in from HDMI connection - something needed to prevent this when the PCB is off?
  -Add RTC - example: https://www.xilinx.com/support/documents/boards_and_kits/zynq-7000/zc706-schematic-xtp215-rev1-1.pdf
  -On inductor pads, shrink .9mm vias to .6 so that they are filled
- Temporary fan header, mounting.
  Replace based on actual fan selected.
  To do: Fan control based on temp?
sheet 2
- Power Indicators
- Buck Converters
- Sequence: 1V0, 1V8, 1V35, 3V3
- 1V0
- This BSH103 requires about 1V to turn on,
  so a different transistor / solution will be neeeded.
- 3V3
- 1V8
- DDR3L Bus Termination Voltage (VTT)
- 1V35
sheet 3
- PLL
- SoC Bypass Capacitors
- To do:
  -Verify ferrite bead specs for analog power, PLL
- ...
- DC Barrel,
  PWR Select
- Analog
- On-chip reference.
  VCCAUX is using 1V8. See UG480.
  *Need to select specific ferrites yet.
- Hold 3.5A
  Trip 7A
  6 VDC
- Chassis Ground
- Schottky Rectifier
- UG933
sheet 4
- Fly-by routing:
  PS to LSW to MSW to VTT Term
- DDR3L
- LSW
- MSW
- ...
- Bypass Caps DDR Term
- Bypass Caps DDR MSW
- For DDR VDD
- For DDR VDDQ
- Bypass Caps DDR LSW
- For DDR VDD
- For DDR VDDQ
sheet 5
- USB
- Programming, Serial
- Hold 500mA
  Trip 1A
  15 VDC
  Time 100ms
- ADBUS4 pull-up to 3.3V
  See https://etherealwake.com/2024/06/xilinx-ftdi-jtag/.
- ADBUS7 (SRST_B) is an output that connects to the PS_SRST_B signal
  on Zynq parts. Like POR_B, this must be buffered with an open-collector output.
  See https://etherealwake.com/2024/06/xilinx-ftdi-jtag/.
- USB-C Physical Connector
  for Power, Programming
- From @asmi06: add a comparator (I use MCP6541T-E/OT) to pin ADBUS4
  such that if your board is powered externally (and not through USB - which is
  how most of my boards are powered because USB just doesn't provide
  enough juice for devices like Artix-A100T), ADBUS4 would only go high
  if main power is connected
- Should the two pairs of USB data
  lines be connected? Currently,
  the orientation of the data
  connection matters (flipping
  connector).
- CG0402MLU-3.3G
- Configure EEPROM
  with program_ftdi.
- See UG908
- -added 12K pullups on CLK and CS
sheet 6
- Ethernet
- ...
- <<<
- <<<
